# EAGLE design AutoTunerV3 (EAGLE 9.6.2)

## Sheet 1 of 4: mcu
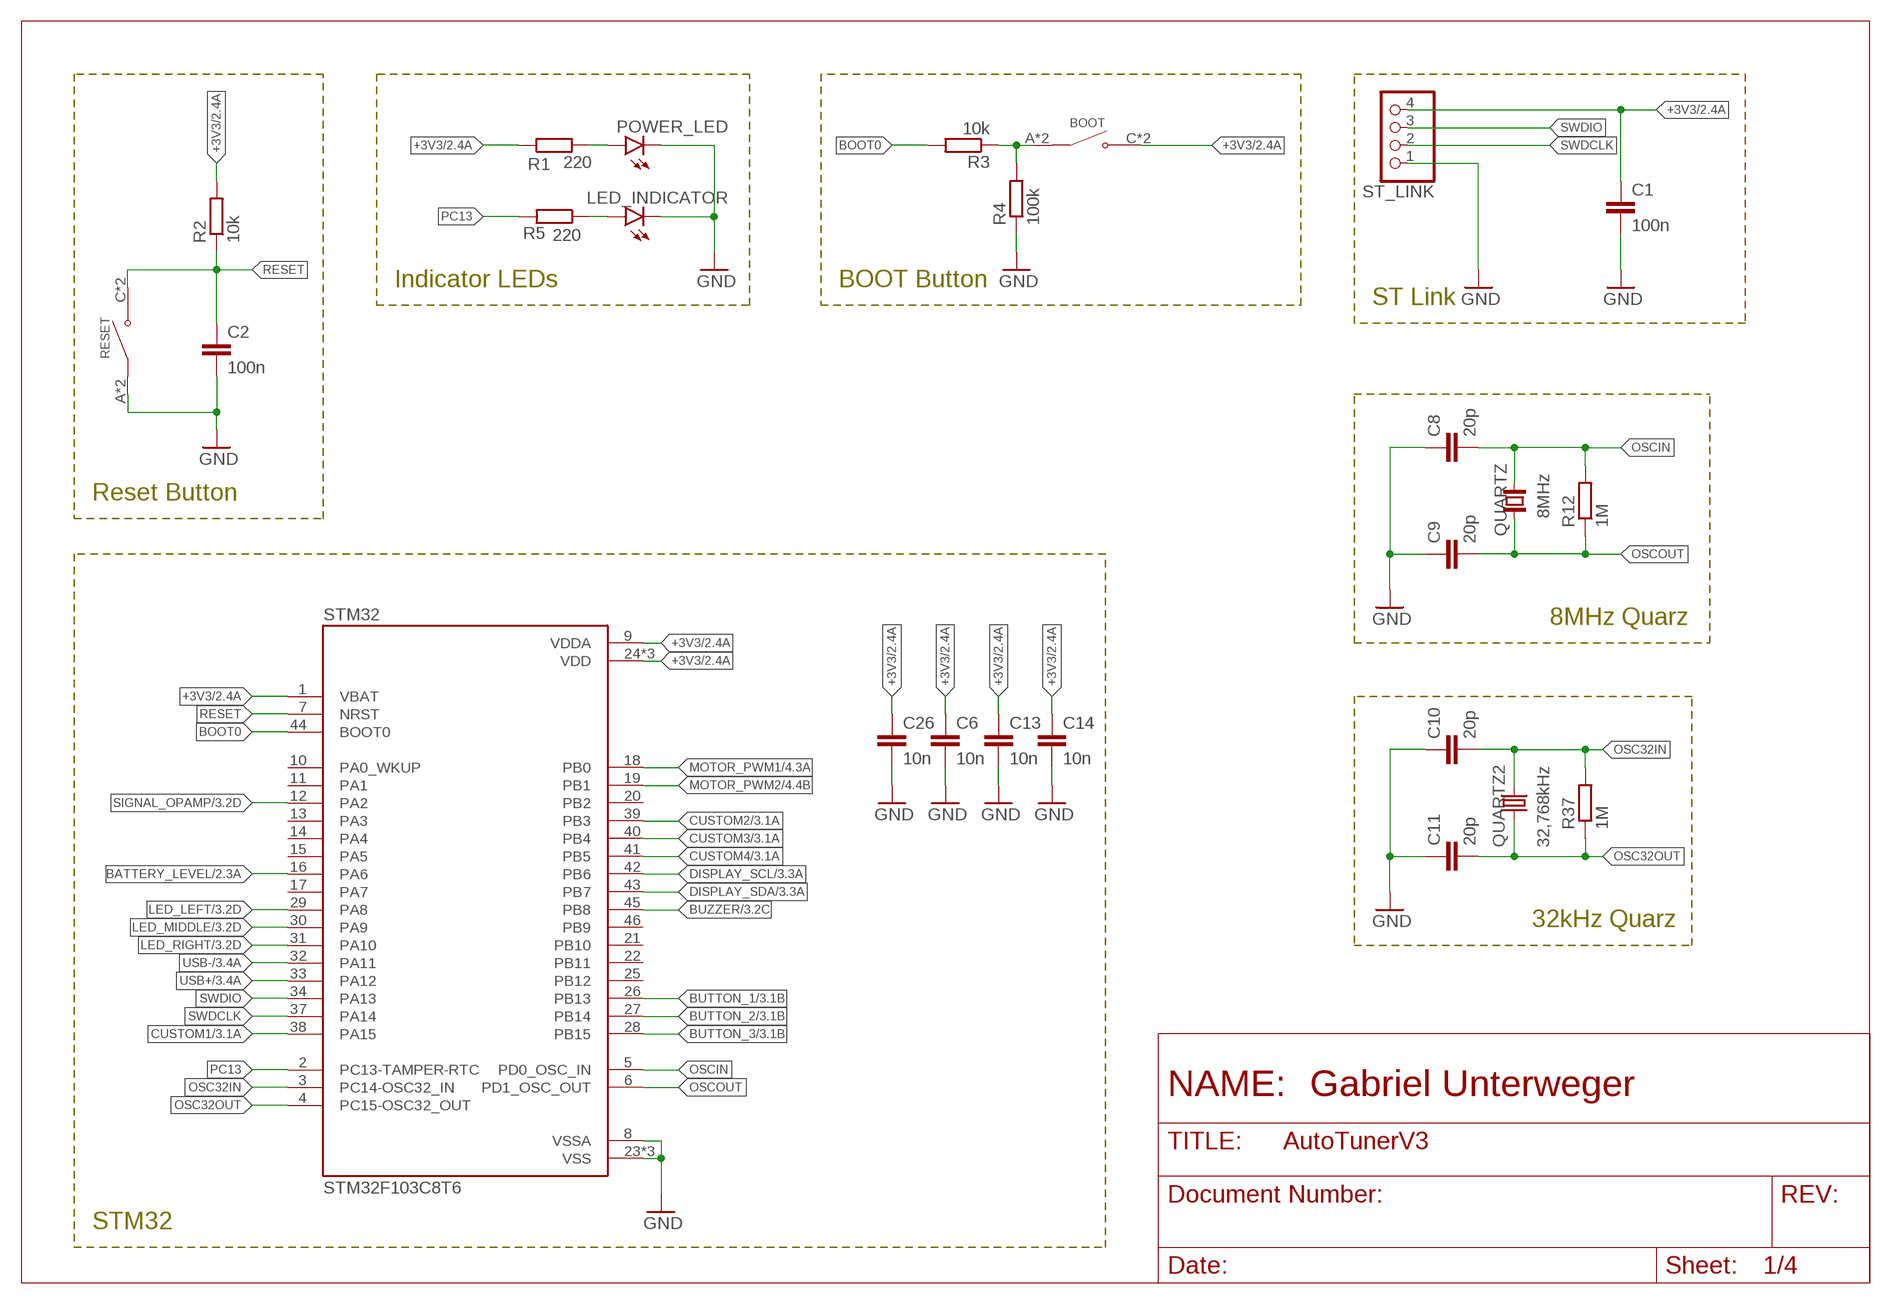
[diagram p0: schematic, sheet 1]

### Parts
BOOT  TS-1187A-B-A-B  [SW_TS-1187A-B-A-B]
C1  100n  C-EUC0805  [C0805]
C2  100n  C-EUC0805  [C0805]
C6  10n  C-EUC0805  [C0805]
C8  20p  C-EUC0805  [C0805]
C9  20p  C-EUC0805  [C0805]
C10  20p  C-EUC0805  [C0805]
C11  20p  C-EUC0805  [C0805]
C13  10n  C-EUC0805  [C0805]
C14  10n  C-EUC0805  [C0805]
C26  10n  C-EUC0805  [C0805]
LED_INDICATOR  LEDCHIPLED_0805  [CHIPLED_0805]
POWER_LED  LEDCHIPLED_0805  [CHIPLED_0805]
QUARTZ  8MHz  CRYSTAL_NX5032GA  [CRYSTAL_2-SMD-5X3]
QUARTZ2  32,768kHz  KX-327-NHF  [3.2X1.5]
R1  220  R-EU_R0805  [R0805]
R2  10k  R-EU_R0805  [R0805]
R3  10k  R-EU_R0805  [R0805]
R4  100k  R-EU_R0805  [R0805]
R5  220  R-EU_R0805  [R0805]
R12  1M  R-EU_R0805  [R0805]
R37  1M  R-EU_R0805  [R0805]
RESET  TS-1187A-B-A-B  [SW_TS-1187A-B-A-B]
ST_LINK  PINHD-1X4/90  [1X04/90]
STM32  STM32F103C8T6  [QFP50P900X900X160-48N]

### Nets
+3V3: BOOT.C(NO) BOOT.D(NO) C1.1 C6.1 C13.1 C14.1 C26.1 R1.1 R2.2 ST_LINK.4 STM32.1(VBAT) STM32.9(VDDA) STM32.24(VDD) STM32.36(VDD) STM32.48(VDD) ; also sheet 2,3,4
BATTERY_LEVEL: STM32.16(PA6) ; also sheet 2
BOOT0: R3.2 STM32.44(BOOT0)
BUTTON_1: STM32.26(PB13) ; also sheet 3
BUTTON_2: STM32.27(PB14) ; also sheet 3
BUTTON_3: STM32.28(PB15) ; also sheet 3
BUZZER: STM32.45(PB8) ; also sheet 3
CUSTOM1: STM32.38(PA15) ; also sheet 3
CUSTOM2: STM32.39(PB3) ; also sheet 3
CUSTOM3: STM32.40(PB4) ; also sheet 3
CUSTOM4: STM32.41(PB5) ; also sheet 3
DISPLAY_SCL: STM32.42(PB6) ; also sheet 3
DISPLAY_SDA: STM32.43(PB7) ; also sheet 3
GND: C1.2 C2.2 C6.2 C8.1 C9.1 C10.1 C11.1 C13.2 C14.2 C26.2 LED_INDICATOR.C POWER_LED.C R4.1 RESET.A(COM) RESET.B(COM) ST_LINK.1 STM32.8(VSSA) STM32.23(VSS) STM32.35(VSS) STM32.47(VSS) ; also sheet 2,3,4
LED_LEFT: STM32.29(PA8) ; also sheet 3
LED_MIDDLE: STM32.30(PA9) ; also sheet 3
LED_RIGHT: STM32.31(PA10) ; also sheet 3
MOTOR_PWM1: STM32.18(PB0) ; also sheet 4
MOTOR_PWM2: STM32.19(PB1) ; also sheet 4
N$1: POWER_LED.A R1.2
N$2: LED_INDICATOR.A R5.1
N$5: BOOT.A(COM) BOOT.B(COM) R3.1 R4.2
OSC32IN: C10.2 QUARTZ2.2 R37.2 STM32.3(PC14-OSC32_IN)
OSC32OUT: C11.2 QUARTZ2.1 R37.1 STM32.4(PC15-OSC32_OUT)
OSCIN: C8.2 QUARTZ.2 R12.2 STM32.5(PD0_OSC_IN)
OSCOUT: C9.2 QUARTZ.1 R12.1 STM32.6(PD1_OSC_OUT)
PC13: R5.2 STM32.2(PC13-TAMPER-RTC)
RESET: C2.1 R2.1 RESET.C(NO) RESET.D(NO) STM32.7(NRST)
SIGNAL_OPAMP: STM32.12(PA2) ; also sheet 3,4
SWDCLK: ST_LINK.2 STM32.37(PA14)
SWDIO: ST_LINK.3 STM32.34(PA13)
USB+: STM32.33(PA12) ; also sheet 3
USB-: STM32.32(PA11) ; also sheet 3
Unconnected: STM32.10(PA0_WKUP) STM32.11(PA1) STM32.13(PA3) STM32.14(PA4) STM32.15(PA5) STM32.17(PA7) STM32.20(PB2) STM32.21(PB10) STM32.22(PB11) STM32.25(PB12) STM32.46(PB9)

### Notes on the sheet
- Indicator LEDs | BOOT Button
- ST Link
- Reset Button
- 8MHz Quarz
- 32kHz Quarz
- STM32

## Sheet 2 of 4: battery / voltage converter
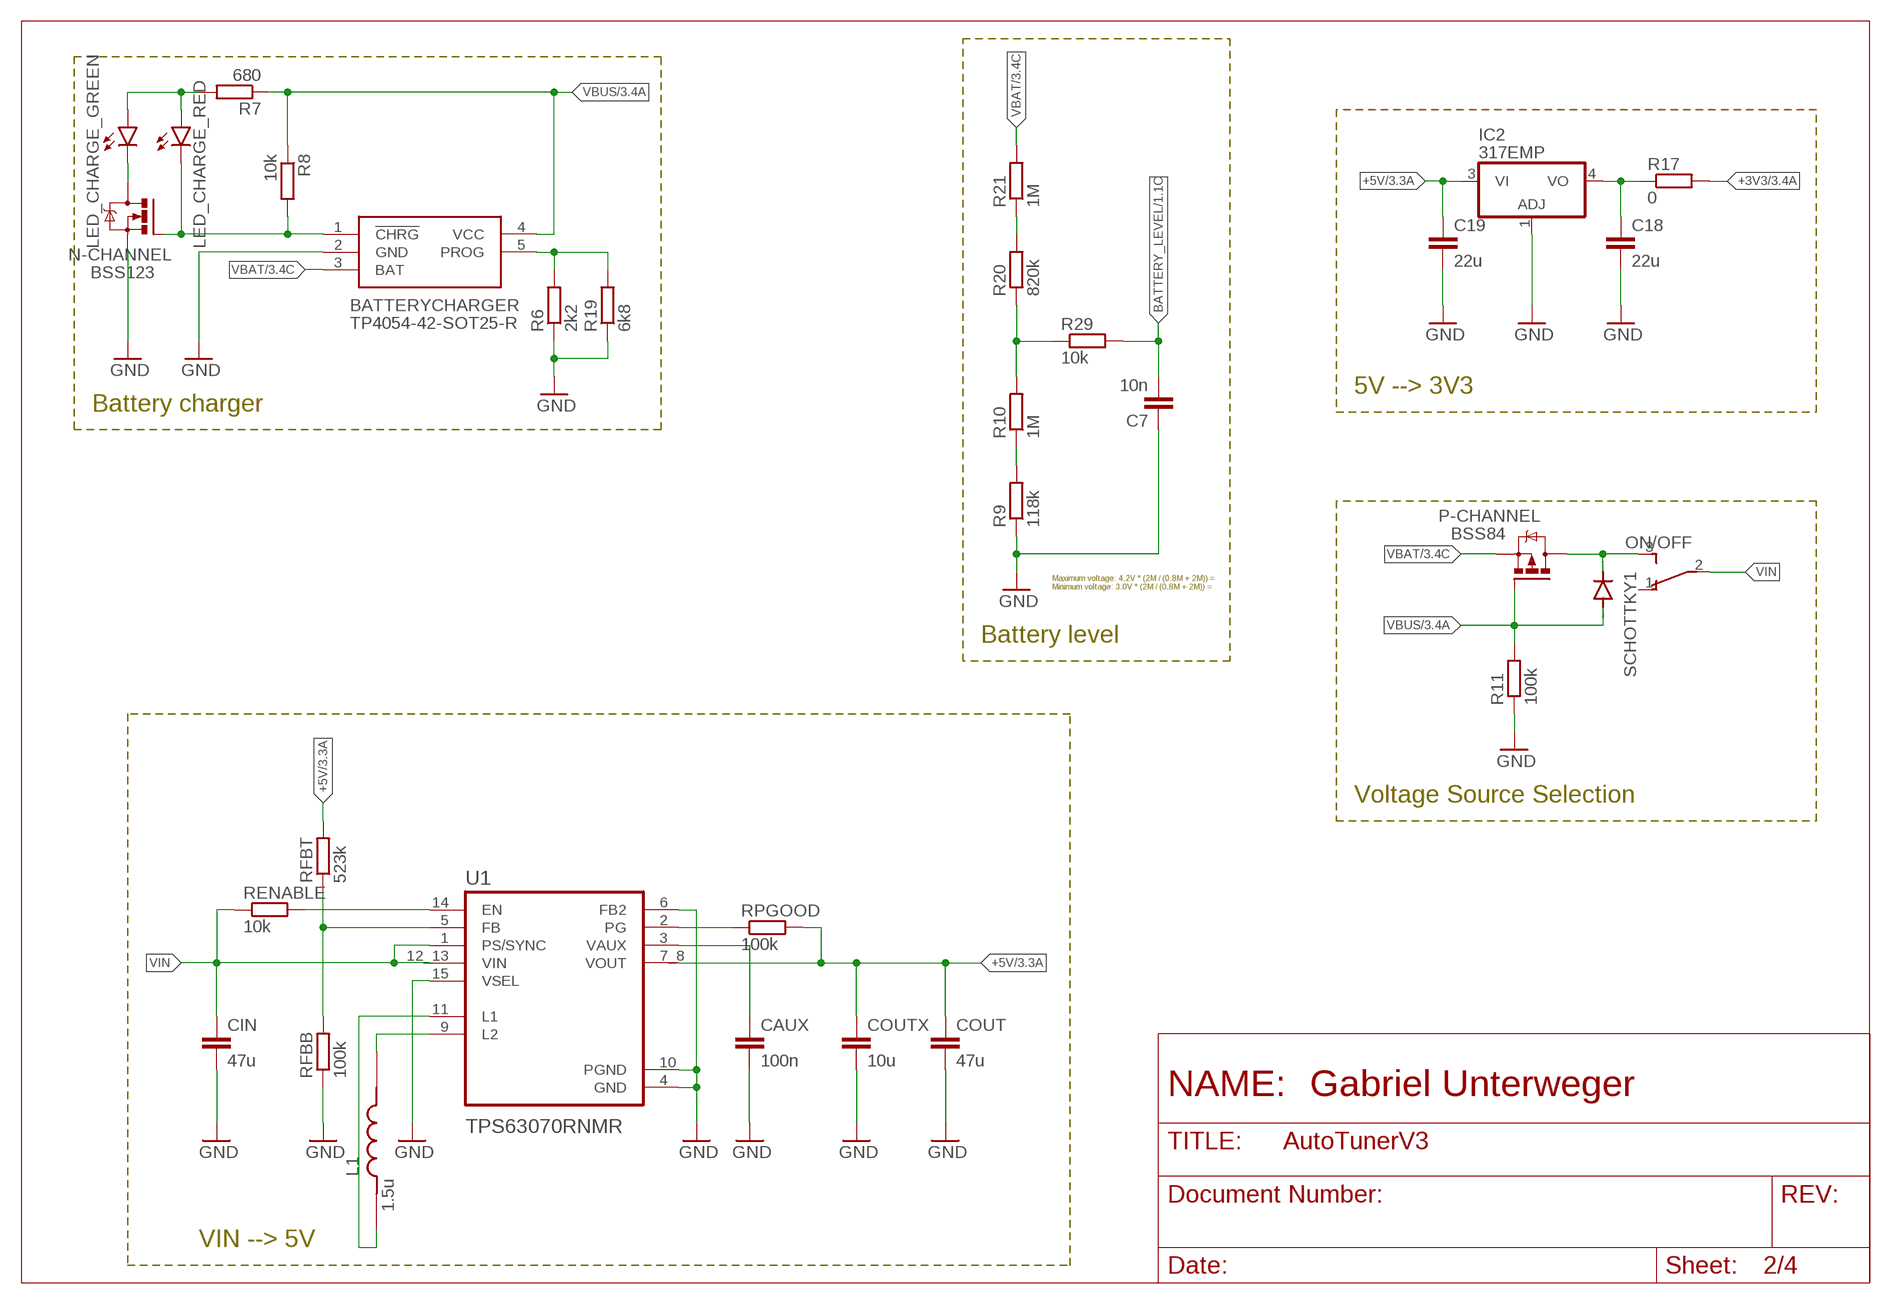
[diagram p1: schematic, sheet 2]

### Parts
BATTERYCHARGER  TP4054-42-SOT25-R  [SOT95P280X100-5N]
C7  10n  C-EUC0805  [C0805]
C18  22u  C-EUC1206  [C1206]
C19  22u  C-EUC1206  [C1206]
CAUX  100n  C-EUC0402  [C0402]
CIN  47u  C-EUC1206  [C1206]
COUT  47u  C-EUC1206  [C1206]
COUTX  10u  C-EUC0603  [C0603]
IC2  317EMP  [SOT223]
L1  1.5u  XFL4020-152MEC  [IND_XFL4020-152MEC]
LED_CHARGE_GREEN  LEDCHIPLED_0805  [CHIPLED_0805]
LED_CHARGE_RED  LEDCHIPLED_0805  [CHIPLED_0805]
N-CHANNEL  BSS123  NMOSFET_BSS123_SOT23-GSD  [SOT23]
ON/OFF  TL36PO  [TL3XPO]
P-CHANNEL  BSS84  PMOSFET_BSS84_SOT23-GSD  [SOT23]
R6  2k2  R-EU_R0805  [R0805]
R7  680  R-EU_R0805  [R0805]
R8  10k  R-EU_R0805  [R0805]
R9  118k  R-EU_R0805  [R0805]
R10  1M  R-EU_R0805  [R0805]
R11  100k  R-EU_R0805  [R0805]
R17  0  R-EU_R0805  [R0805]
R19  6k8  R-EU_R0805  [R0805]
R20  820k  R-EU_R0805  [R0805]
R21  1M  R-EU_R0805  [R0805]
R29  10k  R-EU_R0805  [R0805]
RENABLE  10k  R-EU_R0805  [R0805]
RFBB  100k  R-EU_R0805  [R0805]
RFBT  523k  R-EU_R0805  [R0805]
RPGOOD  100k  R-EU_R0805  [R0805]
SCHOTTKY1  DIODE-SOD323-R  [SOD323-R]
U1  TPS63070RNMR  [VREG_TPS63070RNMR]

### Nets
+3V3: R17.2 ; also sheet 1,3,4
+5V: C19.1 COUT.1 COUTX.1 IC2.3(VI) RFBT.2 RPGOOD.2 U1.7_8(VOUT) ; also sheet 3
BATTERY_LEVEL: C7.2 R29.2 ; also sheet 1
GND: BATTERYCHARGER.2(GND) C7.1 C18.2 C19.2 CAUX.2 CIN.2 COUT.2 COUTX.2 IC2.1(ADJ) N-CHANNEL.2(S) R6.1 R9.1 R11.1 R19.1 RFBB.1 U1.4(GND) U1.6(FB2) U1.10(PGND) U1.15(VSEL) ; also sheet 1,3,4
L1: L1.1 U1.11(L1)
L2: L1.2 U1.9(L2)
N$3: ON/OFF.3(S) P-CHANNEL.3(D) SCHOTTKY1.C
N$4: R9.2 R10.1
N$8: BATTERYCHARGER.5(PROG) R6.2 R19.2
N$9: BATTERYCHARGER.1(!CHRG) LED_CHARGE_RED.C N-CHANNEL.1(G) R8.2
N$11: LED_CHARGE_GREEN.A LED_CHARGE_RED.A R7.2
N$12: LED_CHARGE_GREEN.C N-CHANNEL.3(D)
N$13: C18.1 IC2.4(VO) R17.1
N$46: R20.2 R21.1
N$47: R10.2 R20.1 R29.1
N$60: CAUX.1 U1.3(VAUX)
N$61: RPGOOD.1 U1.2(PG)
N$62: RFBB.2 RFBT.1 U1.5(FB)
N$64: RENABLE.2 U1.14(EN)
VBAT: BATTERYCHARGER.3(BAT) P-CHANNEL.2(S) R21.2 ; also sheet 3,4
VBUS: BATTERYCHARGER.4(VCC) P-CHANNEL.1(G) R7.1 R8.1 R11.2 SCHOTTKY1.A ; also sheet 3
VIN: CIN.1 ON/OFF.2(P) RENABLE.1 U1.1(PS/SYNC) U1.12_13(VIN)
Unconnected: ON/OFF.1(O)

### Notes on the sheet
- 5V --> 3V3
- Battery charger
- Maximum voltage: 4.2V * (2M / (0.8M + 2M)) =
  Minimum voltage: 3.0V * (2M / (0.8M + 2M)) =
- Battery level
- Voltage Source Selection
- VIN --> 5V

## Sheet 3 of 4: I/O
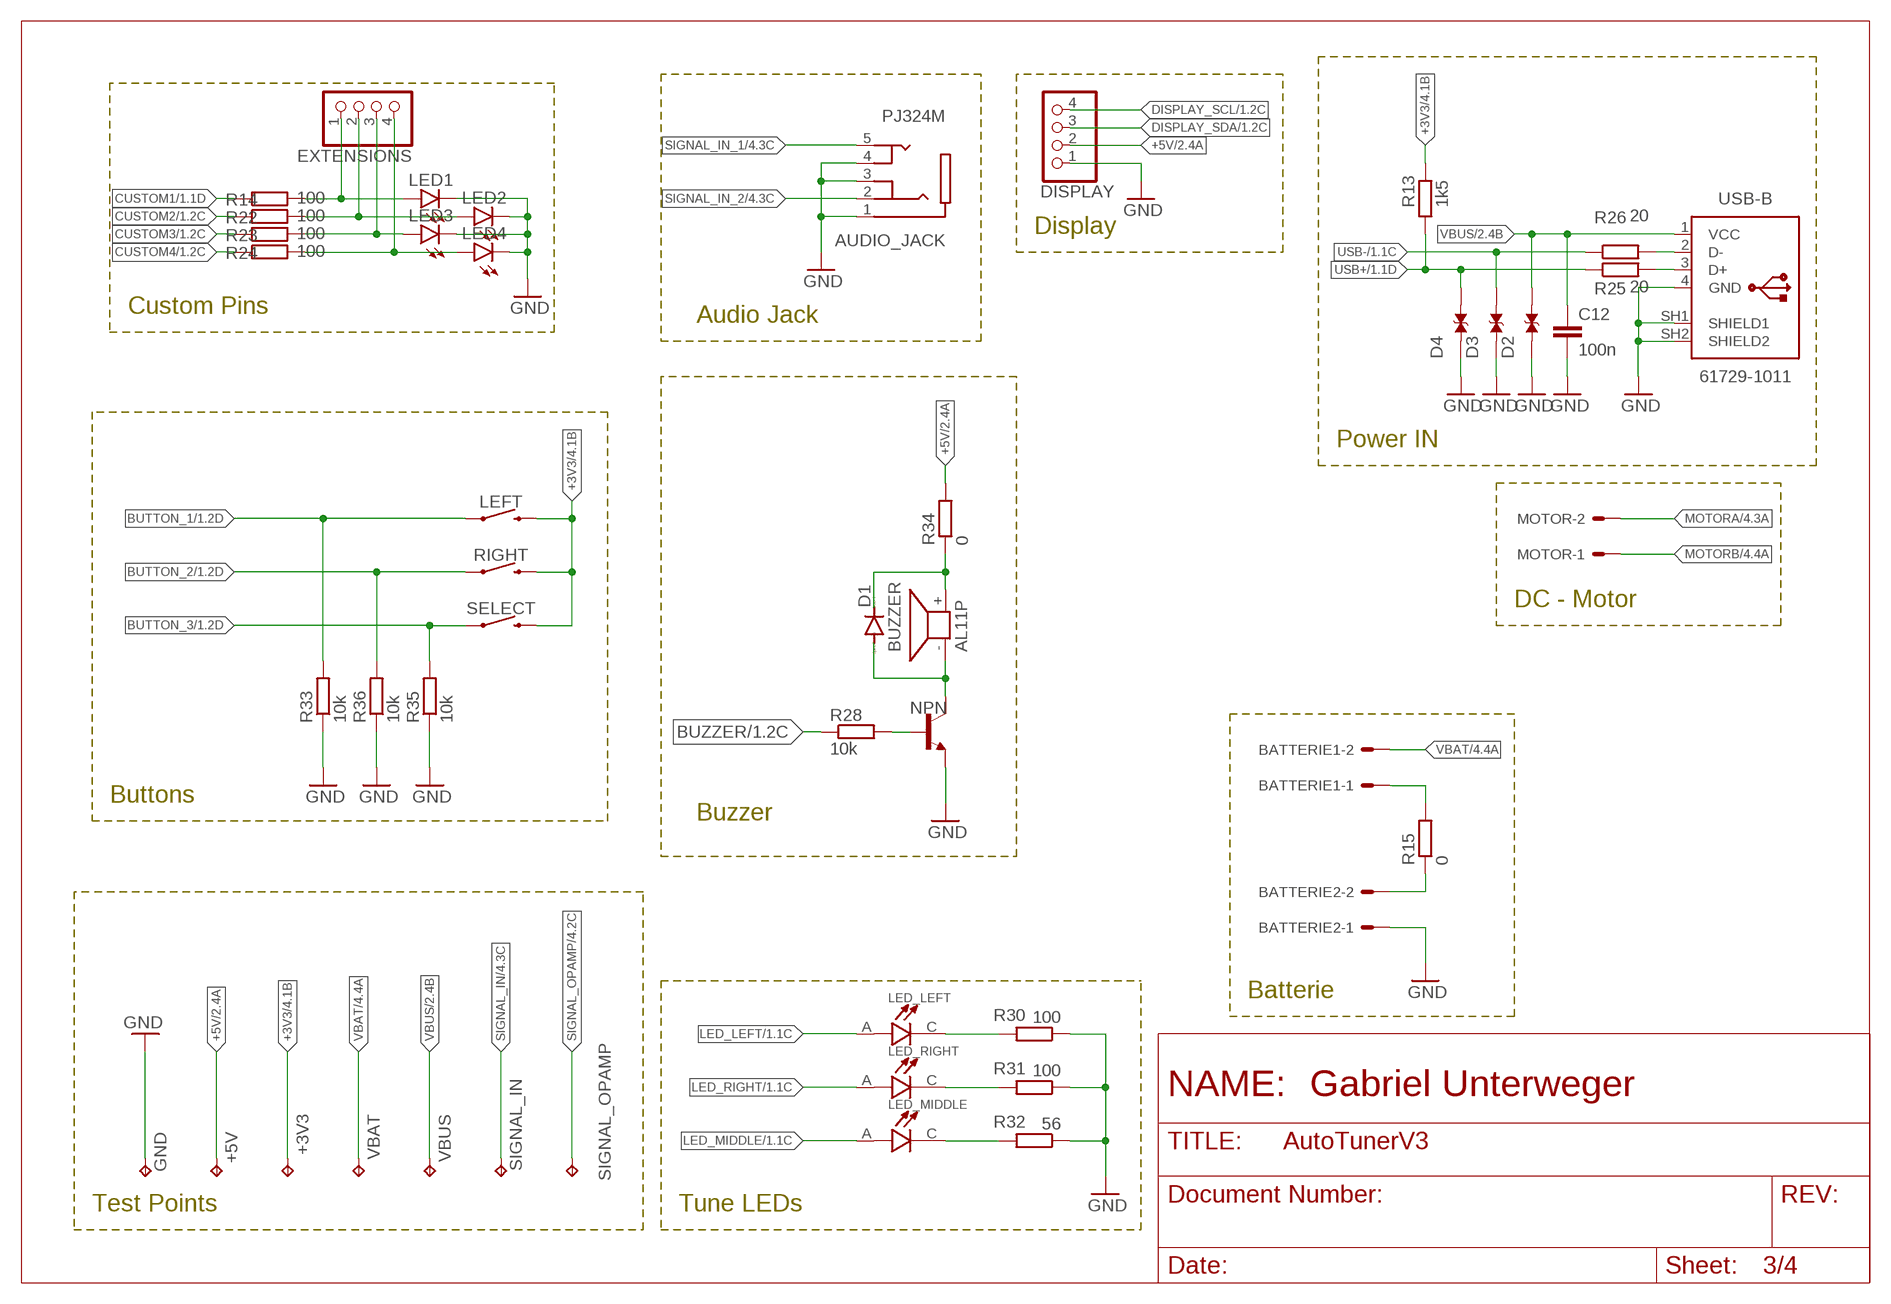
[diagram p2: schematic, sheet 3]

### Parts
+3V3  TPB1,27  [B1,27]
+5V  TPB1,27  [B1,27]
AUDIO_JACK  PJ324M  [WENZHOU_PJ324M]
BATTERIE1  22-27-2021-02  [6410-02]
BATTERIE2  22-27-2021-02  [6410-02]
BUZZER  AL11P  [AL11P]
C12  100n  C-EUC0805  [C0805]
D1  DIODE-SOD323-R  [SOD323-R]
D2  TESD5V0L1UC_RJG  [DIO_TESD5V0L1UC_RJG]
D3  TESD5V0L1UC_RJG  [DIO_TESD5V0L1UC_RJG]
D4  TESD5V0L1UC_RJG  [DIO_TESD5V0L1UC_RJG]
DISPLAY  PINHD-1X4  [1X04]
EXTENSIONS  PINHD-1X4/90  [1X04/90]
GND  TPB1,27  [B1,27]
LED1  LEDCHIP-LED0805  [CHIP-LED0805]
LED2  LEDCHIP-LED0805  [CHIP-LED0805]
LED3  LEDCHIP-LED0805  [CHIP-LED0805]
LED4  LEDCHIP-LED0805  [CHIP-LED0805]
LED_LEFT  L-53GD  [LEDRD254W50D500H1060]
LED_MIDDLE  L-53GD  [LEDRD254W50D500H1060]
LED_RIGHT  L-53GD  [LEDRD254W50D500H1060]
LEFT  MOMENTARY-SWITCH-SPST-PTH-12MM  [TACTILE_SWITCH_PTH_12MM]
MOTOR  22-27-2021-02  [6410-02]
NPN  -NPN-SOT23-EBC  [SOT23-EBC]
R13  1k5  R-EU_R0805  [R0805]
R14  100  R-EU_R0805  [R0805]
R15  0  R-EU_R0805  [R0805]
R22  100  R-EU_R0805  [R0805]
R23  100  R-EU_R0805  [R0805]
R24  100  R-EU_R0805  [R0805]
R25  20  R-EU_R0805  [R0805]
R26  20  R-EU_R0805  [R0805]
R28  10k  R-EU_R0805  [R0805]
R30  100  R-EU_R0805  [R0805]
R31  100  R-EU_R0805  [R0805]
R32  56  R-EU_R0805  [R0805]
R33  10k  R-EU_R0805  [R0805]
R34  0  R-EU_R0805  [R0805]
R35  10k  R-EU_R0805  [R0805]
R36  10k  R-EU_R0805  [R0805]
RIGHT  MOMENTARY-SWITCH-SPST-PTH-12MM  [TACTILE_SWITCH_PTH_12MM]
SELECT  MOMENTARY-SWITCH-SPST-PTH-12MM  [TACTILE_SWITCH_PTH_12MM]
SIGNAL_IN  TPB1,27  [B1,27]
SIGNAL_OPAMP  TPB1,27  [B1,27]
USB-B  61729-1011  [61729-1011BLF]
VBAT  TPB1,27  [B1,27]
VBUS  TPB1,27  [B1,27]

### Nets
+3V3: +3V3.TP LEFT.3 R13.2 RIGHT.3 SELECT.3 ; also sheet 1,2,4
+5V: +5V.TP DISPLAY.2 R34.2 ; also sheet 2
BUTTON_1: LEFT.1 R33.2 ; also sheet 1
BUTTON_2: R36.2 RIGHT.1 ; also sheet 1
BUTTON_3: R35.2 SELECT.1 ; also sheet 1
BUZZER: R28.1 ; also sheet 1
CUSTOM1: R14.1 ; also sheet 1
CUSTOM2: R22.1 ; also sheet 1
CUSTOM3: R23.1 ; also sheet 1
CUSTOM4: R24.1 ; also sheet 1
DISPLAY_SCL: DISPLAY.4 ; also sheet 1
DISPLAY_SDA: DISPLAY.3 ; also sheet 1
GND: AUDIO_JACK.1(SLEEVE) AUDIO_JACK.3(RING_2) AUDIO_JACK.4(TIP_1) BATTERIE2.1 C12.2 D2.1 D3.1 D4.1 DISPLAY.1 GND.TP LED1.C LED2.C LED3.C LED4.C NPN.E R30.1 R31.1 R32.1 R33.1 R35.1 R36.1 USB-B.4(GND) USB-B.SH1(SHIELD1) USB-B.SH2(SHIELD2) ; also sheet 1,2,4
LED_LEFT: LED_LEFT.A ; also sheet 1
LED_MIDDLE: LED_MIDDLE.A ; also sheet 1
LED_RIGHT: LED_RIGHT.A ; also sheet 1
MOTORA: MOTOR.2 ; also sheet 4
MOTORB: MOTOR.1 ; also sheet 4
N$19: LED_LEFT.C R30.2
N$20: LED_RIGHT.C R31.2
N$23: LED_MIDDLE.C R32.2
N$29: R25.2 USB-B.3(D+)
N$30: R26.2 USB-B.2(D-)
N$39: EXTENSIONS.1 LED1.A R14.2
N$48: EXTENSIONS.2 LED2.A R22.2
N$49: EXTENSIONS.3 LED3.A R23.2
N$50: EXTENSIONS.4 LED4.A R24.2
N$51: BATTERIE2.2 R15.1
N$53: BATTERIE1.1 R15.2
N$54: BUZZER.- D1.A NPN.C
N$55: BUZZER.+ D1.C R34.1
N$56: NPN.B R28.2
SIGNAL_IN: SIGNAL_IN.TP ; also sheet 4
SIGNAL_IN_1: AUDIO_JACK.5(TIP_2) ; also sheet 4
SIGNAL_IN_2: AUDIO_JACK.2(RING_1) ; also sheet 4
SIGNAL_OPAMP: SIGNAL_OPAMP.TP ; also sheet 1,4
USB+: D4.2 R13.1 R25.1 ; also sheet 1
USB-: D3.2 R26.1 ; also sheet 1
VBAT: BATTERIE1.2 VBAT.TP ; also sheet 2,4
VBUS: C12.1 D2.2 USB-B.1(VCC) VBUS.TP ; also sheet 2

### Notes on the sheet
- Display
- Custom Pins
- Audio Jack
- Power IN
- DC - Motor
- Buttons
- Buzzer
- Batterie
- Test Points | Tune LEDs

## Sheet 4 of 4: Motor Steuerung / Signal Verarbeitung
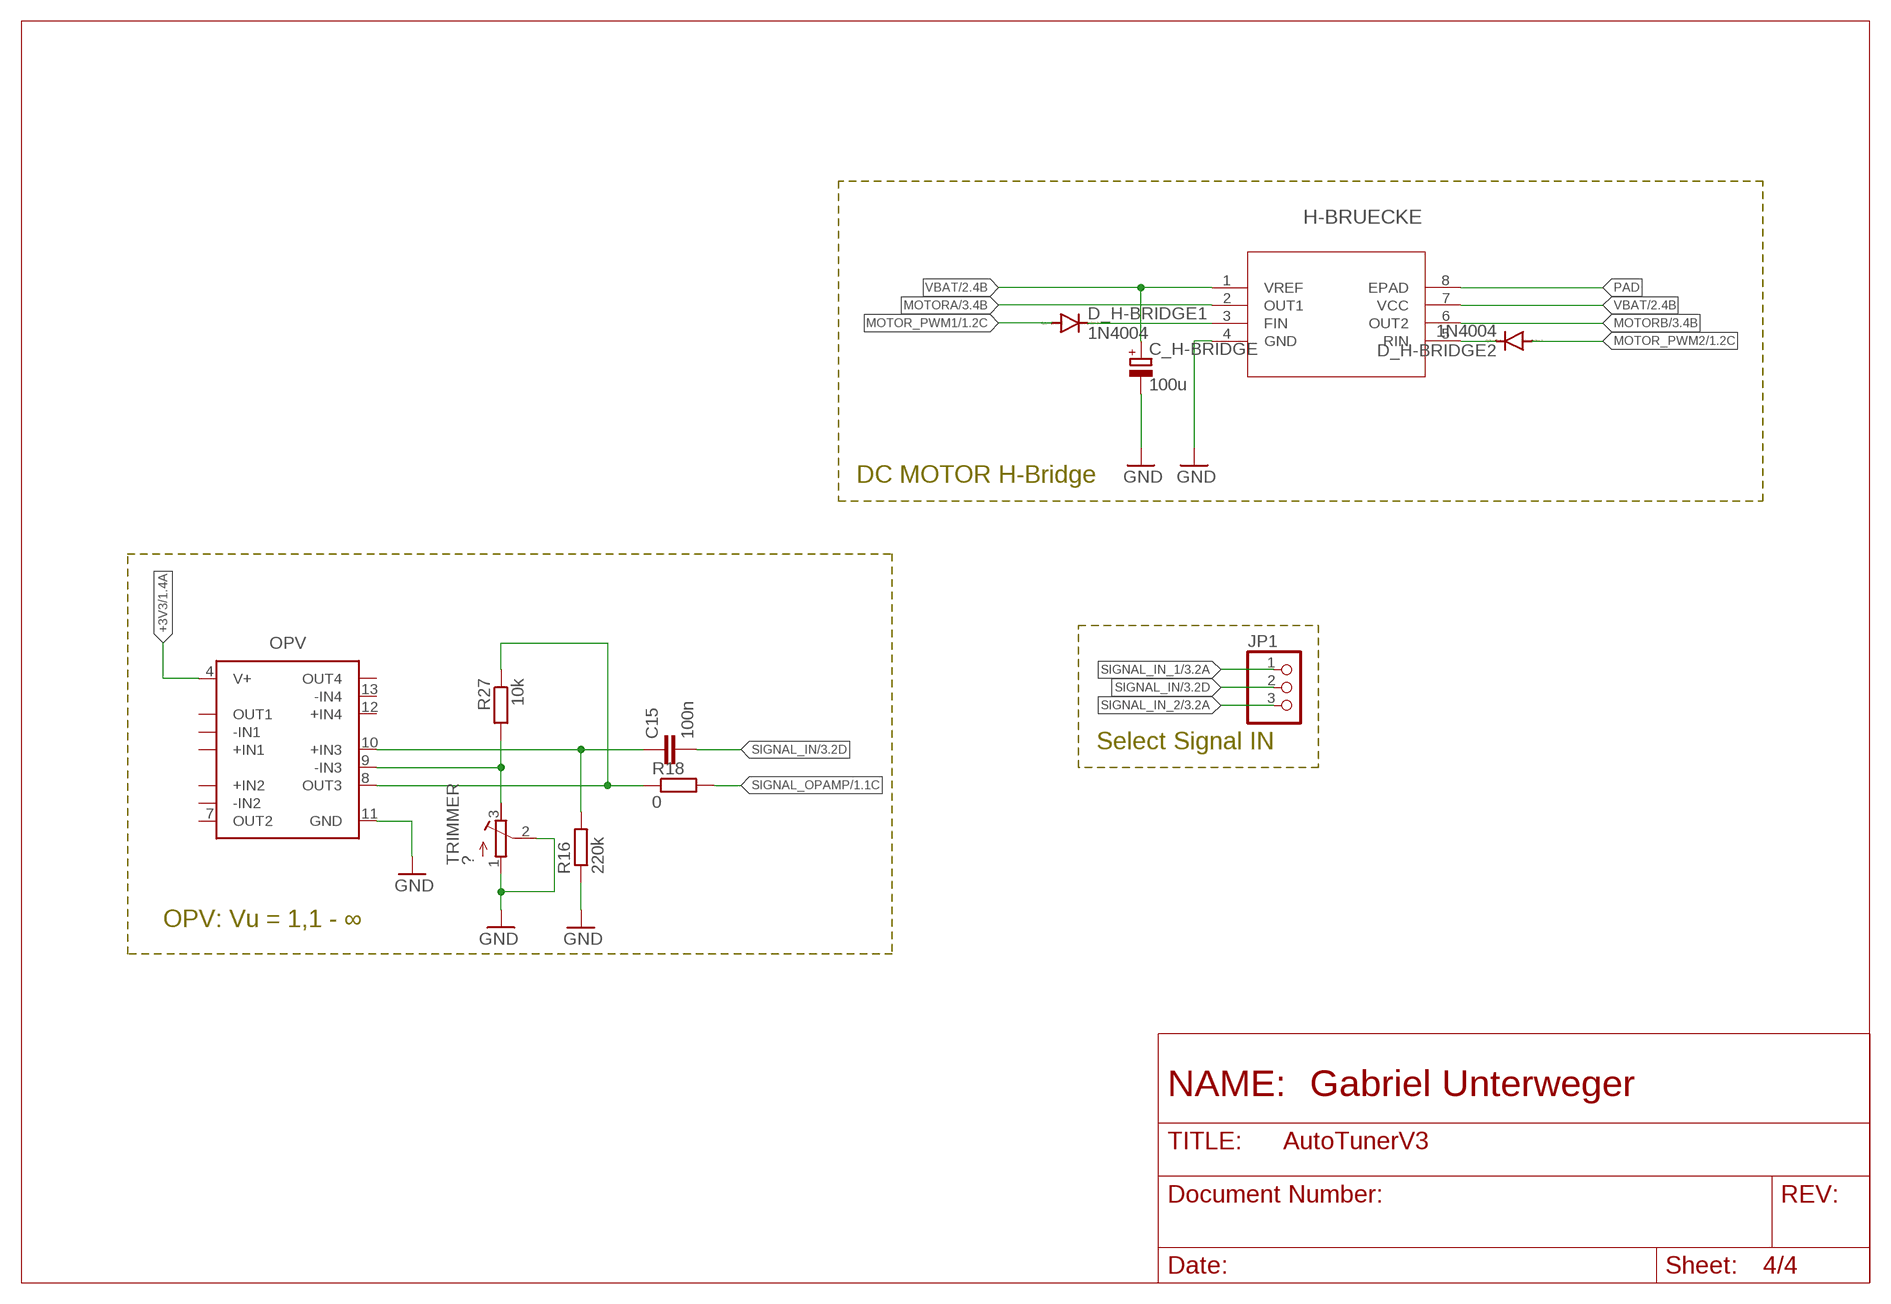
[diagram p3: schematic, sheet 4]

### Parts
C15  100n  C-EUC0805  [C0805]
C_H-BRIDGE  100u  CPOL-EUE2,5-6E  [E2,5-6E]
D_H-BRIDGE1  1N4004  [DO41-10]
D_H-BRIDGE2  1N4004  [DO41-10]
H-BRUECKE  BD6222HFP-TRHRP7_ROM-M  [HRP7_ROM-M]
JP1  PINHD-1X3  [1X03]
OPV  LM324_SOIC  [SOIC127P600X175-14N]
R16  220k  R-EU_R0805  [R0805]
R18  0  R-EU_R0805  [R0805]
R27  10k  R-EU_R0805  [R0805]
TRIMMER  ?  R-TRIMM3339P  [RTRIM3339P]

### Nets
+3V3: OPV.4(V+) ; also sheet 1,2,3
GND: C_H-BRIDGE.- H-BRUECKE.4(GND) OPV.11(GND) R16.1 TRIMMER.1(A) TRIMMER.2(S) ; also sheet 1,2,3
MOTOR_PWM1: D_H-BRIDGE1.A ; also sheet 1
MOTOR_PWM2: D_H-BRIDGE2.A ; also sheet 1
MOTORA: H-BRUECKE.2(OUT1) ; also sheet 3
MOTORB: H-BRUECKE.6(OUT2) ; also sheet 3
N$6: D_H-BRIDGE1.C H-BRUECKE.3(FIN)
N$7: OPV.8(OUT3) R18.1 R27.1
N$14: D_H-BRIDGE2.C H-BRUECKE.5(RIN)
N$16: OPV.9(-IN3) R27.2 TRIMMER.3(E)
N$52: C15.1 OPV.10(+IN3) R16.2
PAD: H-BRUECKE.8(EPAD)
SIGNAL_IN: C15.2 JP1.2 ; also sheet 3
SIGNAL_IN_1: JP1.1 ; also sheet 3
SIGNAL_IN_2: JP1.3 ; also sheet 3
SIGNAL_OPAMP: R18.2 ; also sheet 1,3
VBAT: C_H-BRIDGE.+ H-BRUECKE.1(VREF) H-BRUECKE.7(VCC) ; also sheet 2,3
Unconnected: OPV.1(OUT1) OPV.2(-IN1) OPV.3(+IN1) OPV.5(+IN2) OPV.6(-IN2) OPV.7(OUT2) OPV.12(+IN4) OPV.13(-IN4) OPV.14(OUT4)

### Notes on the sheet
- DC MOTOR H-Bridge
- Select Signal IN
- OPV: Vu = 1,1 - ∞

## Library data of the parts
+3V3 +5V GND SIGNAL_IN SIGNAL_OPAMP VBAT VBUS = testpad:TP: Test pad
AUDIO_JACK = PJ324M:PJ324M: Headphone Stereo jack/Audio connector Check availability <https://pricing.snapeda.com/parts/PJ324M/Wenzhou%20QingPu%20Electronics%20Co.Ltd/view-part?ref=eda>; AVAILABILITY: Not in stock; CHECK_PRICES: https://www.snapeda.com/parts/PJ324M/Wenzhou+QingPu+Electronics+Co.Ltd/view-part/?ref=eda; DESCRIPTION: Headphone Stereo jack/Audio connector; MF: Wenzhou QingPu Electronics Co.Ltd; MP: PJ324M; PACKAGE: Package; PRICE: None; SNAPEDA_LINK: https://www.snapeda.com/parts/PJ324M/Wenzhou+QingPu+Electronics+Co.Ltd/view-part/?ref=snap
BATTERIE1 BATTERIE2 MOTOR = con-molex:22-?-02: CONNECTOR wire to board 2.54 mm (.1 inch) pitch header; MF: MOLEX; OC_FARNELL: unknown; OC_NEWARK: unknown
BATTERYCHARGER = TP4054-42-SOT25-R:TP4054-42-SOT25-R: Standalone Linear Li-ion Battery Charger with Thermal Regulation, SOT-23-5 Source: Datasheet <http://images.100y.com.tw/pdf_file/38-TP-TP4054x.pdf>; DESCRIPTION: Standalone Linear Li-ion Battery Charger with Thermal Regulation, SOT-23-5; HEIGHT: 1mm; LCSC_PART: C32574; MANUFACTURER_NAME: TOP POWER; MANUFACTURER_PART_NUMBER: TP4054-42-SOT25-R
BOOT RESET = TS-1187A-B-A-B:TS-1187A-B-A-B: SPST 50mA @ 12VDC Top Actuated Round Button 160gf SMD Tactile Switches RoHS Check availability <https://pricing.snapeda.com/parts/TS-1187A-B-A-B/XKB%20Industrial%20Precision/view-part?ref=eda>; AVAILABILITY: Not in stock; DESCRIPTION: TS-1187A-B-A-B XKB Connectivity; LCSC_PART: C318884; MF: XKB Industrial Precision; MP: TS-1187A-B-A-B; PACKAGE: Package; PRICE: None
BUZZER = buzzer:AL11P: SPEAKER Source: Buerklin; OC_FARNELL: unknown; OC_NEWARK: unknown
C1 C2 C6-C15 C26 = rcl:C-EU: CAPACITOR, European symbol; SPICEPREFIX: C
C18 C19 = rcl:C-EU: CAPACITOR, European symbol; LCSC_PART: C12891; SPICEPREFIX: C
C_H-BRIDGE = rcl:CPOL-EU: POLARIZED CAPACITOR, European symbol; SPICEPREFIX: C
CAUX = rcl:C-EU: CAPACITOR, European symbol; LCSC_PART: C1525; SPICEPREFIX: C
CIN COUT = rcl:C-EU: CAPACITOR, European symbol; LCSC_PART: C96123; SPICEPREFIX: C
COUTX = rcl:C-EU: CAPACITOR, European symbol; LCSC_PART: C19702; SPICEPREFIX: C
D1 = diode:DIODE-: DIODE; LCSC_PART: C2128
D2-D4 = TESD5V0L1UC_RJG:TESD5V0L1UC_RJG: Check availability <https://pricing.snapeda.com/parts/TESD5V0L1UC%20RJG/Taiwan%20Semiconductor%20Corporation/view-part?ref=eda>; AVAILABILITY: In Stock; CHECK_PRICES: https://www.snapeda.com/parts/TESD5V0L1UC%20RJG/Taiwan+Semiconductor/view-part/?ref=eda; DESCRIPTION: DFN1006L, 5V, 100W, 2pF, ESD Protection Diode & Array; LCSC_PART: C7420372; MF: Taiwan Semiconductor Corporation; MP: TESD5V0L1UC RJG; PACKAGE: DFN1006L Taiwan Semiconductor; PRICE: None; PURCHASE-URL: https://www.snapeda.com/api/url_track_click_mouser/?unipart_id=3789592&manufacturer=Taiwan Semiconductor Corporation&part_name=TESD5V0L1UC RJG&search_term=protection diode; SNAPEDA_LINK: https://www.snapeda.com/parts/TESD5V0L1UC%20RJG/Taiwan+Semiconductor/view-part/?ref=snap
D_H-BRIDGE1 D_H-BRIDGE2 = diode:1N4004: DIODE general purpose rectifier, 1 A
DISPLAY EXTENSIONS ST_LINK = pinhead:PINHD-1X4: PIN HEADER
H-BRUECKE = H-Brücke_BD622HFP-TR02:BD6222HFP-TR; COPYRIGHT: Copyright (C) 2022 Ultra Librarian. All rights reserved.; MANUFACTURER_PART_NUMBER: BD6222HFP-TR; MFR_NAME: ROHM Semiconductor
IC2 = linear:*317: Positive VOLTAGE REGULATOR; LCSC_PART: C6186
JP1 = pinhead:PINHD-1X3: PIN HEADER
L1 = XFL4020-152MEC:XFL4020-152MEC: Power inductor, shielded, 20% tol, SMT, RoHS, halogen free Check availability <https://pricing.snapeda.com/parts/XFL4020-152MEC/Coilcraft/view-part?ref=eda>; AVAILABILITY: In Stock; CHECK_PRICES: https://www.snapeda.com/parts/XFL4020-152MEC/Coilcraft/view-part/?ref=eda; DESCRIPTION: Inductor Power Shielded Wirewound 1.5uH 20% 100KHz 9.1A 15.8mOhm DCR 1515 Automotive Embossed Plastic T/R; LCSC_PART: C3033018; MF: Coilcraft; MP: XFL4020-152MEC; PACKAGE: None; PRICE: None; PURCHASE-URL: https://www.snapeda.com/api/url_track_click_mouser/?unipart_id=583942&manufacturer=Coilcraft&part_name=XFL4020-152MEC&search_term=xfl4020-152mec; SNAPEDA_LINK: https://www.snapeda.com/parts/XFL4020-152MEC/Coilcraft/view-part/?ref=snap
LED1-LED4 LED_CHARGE_GREEN POWER_LED = led:LED: LED OSRAM: - CHIPLED LG R971, LG N971, LY N971, LG Q971, LY Q971, LO R971, LY R971 LH N974, LH R974 LS Q976, LO Q976, LY Q976 LO Q996 - Hyper CHIPLED LW Q18S LB Q993, LB Q99A, LB R99A - SideLED LS A670, LO A670, LY A670, LG A670, LP A670 LB A673, LV A673, LT A673, LW A673 LH A674 LY A675 LS A676, LA A676, LO A676, LY A676, LW A676 LS A679, LY A679, LG A679 - Hyper Micro SIDELED® LS Y876, LA Y876, LO Y876, LY Y876 LT Y87S - SmartLED LW L88C, LW L88S LB L89C, LB L89S, LG L890 LS L89K, LO L89K, LY L89K LS L896, LA L896, LO L896, LY L896 - TOPLED LS T670, LO T670, LY T670, LG T670, LP T670 LSG T670, LSP T670, LSY T670, LOP T670, LYG T670 LG T671, LOG T671, LSG T671 LB T673, LV T673, LT T673, LW T673 LH T674 LS T676, LA T676, LO T676, LY T676, LB T676, LH T676, LSB T676, LW T676 LB T67C, LV T67C, LT T67C, LS T67K, LO T67K, LY T67K, LW E67C LS E67B, LA E67B, LO E67B, LY E67B, LB E67C, LV E67C, LT E67C LW T67C LS T679, LY T679, LG T679 LS T770, LO T770, LY T770, LG T770, LP T770 LB T773, LV T773, LT T773, LW T773 LH T774 LS E675, LA E675, LY E675, LS T675 LS T776, LA T776, LO T776, LY T776, LB T776 LHGB T686 LT T68C, LB T68C - Hyper Mini TOPLED® LB M676 - Mini TOPLED Santana® LG M470 LS M47K, LO M47K, LY M47K Source: http://www.osram.convergy.de LUXEON: - LUMILED® LXK2-PW12-R00, LXK2-PW12-S00, LXK2-PW14-U00, LXK2-PW14-V00 LXK2-PM12-R00, LXK2-PM12-S00, LXK2-PM14-U00 LXK2-PE12-Q00, LXK2-PE12-R00, LXK2-PE12-S00, LXK2-PE14-T00, LXK2-PE14-U00 LXK2-PB12-K00, LXK2-PB12-L00, LXK2-PB12-M00, LXK2-PB14-N00, LXK2-PB14-P00, LXK2-PB14-Q00 LXK2-PR12-L00, LXK2-PR12-M00, LXK2-PR14-Q00, LXK2-PR14-R00 LXK2-PD12-Q00, LXK2-PD12-R00, LXK2-PD12-S00 LXK2-PH12-R00, LXK2-PH12-S00 LXK2-PL12-P00, LXK2-PL12-Q00, LXK2-PL12-R00 Source: www.luxeon.com KINGBRIGHT: KA-3528ASYC Source: www.kingbright.com; LCSC_PART: C2297
LED_CHARGE_RED = led:LED: LED OSRAM: - CHIPLED LG R971, LG N971, LY N971, LG Q971, LY Q971, LO R971, LY R971 LH N974, LH R974 LS Q976, LO Q976, LY Q976 LO Q996 - Hyper CHIPLED LW Q18S LB Q993, LB Q99A, LB R99A - SideLED LS A670, LO A670, LY A670, LG A670, LP A670 LB A673, LV A673, LT A673, LW A673 LH A674 LY A675 LS A676, LA A676, LO A676, LY A676, LW A676 LS A679, LY A679, LG A679 - Hyper Micro SIDELED® LS Y876, LA Y876, LO Y876, LY Y876 LT Y87S - SmartLED LW L88C, LW L88S LB L89C, LB L89S, LG L890 LS L89K, LO L89K, LY L89K LS L896, LA L896, LO L896, LY L896 - TOPLED LS T670, LO T670, LY T670, LG T670, LP T670 LSG T670, LSP T670, LSY T670, LOP T670, LYG T670 LG T671, LOG T671, LSG T671 LB T673, LV T673, LT T673, LW T673 LH T674 LS T676, LA T676, LO T676, LY T676, LB T676, LH T676, LSB T676, LW T676 LB T67C, LV T67C, LT T67C, LS T67K, LO T67K, LY T67K, LW E67C LS E67B, LA E67B, LO E67B, LY E67B, LB E67C, LV E67C, LT E67C LW T67C LS T679, LY T679, LG T679 LS T770, LO T770, LY T770, LG T770, LP T770 LB T773, LV T773, LT T773, LW T773 LH T774 LS E675, LA E675, LY E675, LS T675 LS T776, LA T776, LO T776, LY T776, LB T776 LHGB T686 LT T68C, LB T68C - Hyper Mini TOPLED® LB M676 - Mini TOPLED Santana® LG M470 LS M47K, LO M47K, LY M47K Source: http://www.osram.convergy.de LUXEON: - LUMILED® LXK2-PW12-R00, LXK2-PW12-S00, LXK2-PW14-U00, LXK2-PW14-V00 LXK2-PM12-R00, LXK2-PM12-S00, LXK2-PM14-U00 LXK2-PE12-Q00, LXK2-PE12-R00, LXK2-PE12-S00, LXK2-PE14-T00, LXK2-PE14-U00 LXK2-PB12-K00, LXK2-PB12-L00, LXK2-PB12-M00, LXK2-PB14-N00, LXK2-PB14-P00, LXK2-PB14-Q00 LXK2-PR12-L00, LXK2-PR12-M00, LXK2-PR14-Q00, LXK2-PR14-R00 LXK2-PD12-Q00, LXK2-PD12-R00, LXK2-PD12-S00 LXK2-PH12-R00, LXK2-PH12-S00 LXK2-PL12-P00, LXK2-PL12-Q00, LXK2-PL12-R00 Source: www.luxeon.com KINGBRIGHT: KA-3528ASYC Source: www.kingbright.com; LCSC_PART: C84256
LED_INDICATOR = led:LED: LED OSRAM: - CHIPLED LG R971, LG N971, LY N971, LG Q971, LY Q971, LO R971, LY R971 LH N974, LH R974 LS Q976, LO Q976, LY Q976 LO Q996 - Hyper CHIPLED LW Q18S LB Q993, LB Q99A, LB R99A - SideLED LS A670, LO A670, LY A670, LG A670, LP A670 LB A673, LV A673, LT A673, LW A673 LH A674 LY A675 LS A676, LA A676, LO A676, LY A676, LW A676 LS A679, LY A679, LG A679 - Hyper Micro SIDELED® LS Y876, LA Y876, LO Y876, LY Y876 LT Y87S - SmartLED LW L88C, LW L88S LB L89C, LB L89S, LG L890 LS L89K, LO L89K, LY L89K LS L896, LA L896, LO L896, LY L896 - TOPLED LS T670, LO T670, LY T670, LG T670, LP T670 LSG T670, LSP T670, LSY T670, LOP T670, LYG T670 LG T671, LOG T671, LSG T671 LB T673, LV T673, LT T673, LW T673 LH T674 LS T676, LA T676, LO T676, LY T676, LB T676, LH T676, LSB T676, LW T676 LB T67C, LV T67C, LT T67C, LS T67K, LO T67K, LY T67K, LW E67C LS E67B, LA E67B, LO E67B, LY E67B, LB E67C, LV E67C, LT E67C LW T67C LS T679, LY T679, LG T679 LS T770, LO T770, LY T770, LG T770, LP T770 LB T773, LV T773, LT T773, LW T773 LH T774 LS E675, LA E675, LY E675, LS T675 LS T776, LA T776, LO T776, LY T776, LB T776 LHGB T686 LT T68C, LB T68C - Hyper Mini TOPLED® LB M676 - Mini TOPLED Santana® LG M470 LS M47K, LO M47K, LY M47K Source: http://www.osram.convergy.de LUXEON: - LUMILED® LXK2-PW12-R00, LXK2-PW12-S00, LXK2-PW14-U00, LXK2-PW14-V00 LXK2-PM12-R00, LXK2-PM12-S00, LXK2-PM14-U00 LXK2-PE12-Q00, LXK2-PE12-R00, LXK2-PE12-S00, LXK2-PE14-T00, LXK2-PE14-U00 LXK2-PB12-K00, LXK2-PB12-L00, LXK2-PB12-M00, LXK2-PB14-N00, LXK2-PB14-P00, LXK2-PB14-Q00 LXK2-PR12-L00, LXK2-PR12-M00, LXK2-PR14-Q00, LXK2-PR14-R00 LXK2-PD12-Q00, LXK2-PD12-R00, LXK2-PD12-S00 LXK2-PH12-R00, LXK2-PH12-S00 LXK2-PL12-P00, LXK2-PL12-Q00, LXK2-PL12-R00 Source: www.luxeon.com KINGBRIGHT: KA-3528ASYC Source: www.kingbright.com; LCSC_PART: C2296
LED_LEFT LED_MIDDLE LED_RIGHT = L-53GD:L-53GD: LED; 5mm; green; 5-32mcd; 60°; Front: convex Check availability <https://pricing.snapeda.com/parts/L-53GD/Kingbright/view-part?ref=eda>; AVAILABILITY: In Stock; CHECK_PRICES: https://www.snapeda.com/parts/L-53GD/Kingbright/view-part/?ref=eda; DESCRIPTION: LED; 5mm; green; 5-32mcd; 60°; Front: convex; MF: Kingbright; MP: L-53GD; PACKAGE: CDIP-28 Kingbright; PRICE: None; PURCHASE-URL: https://www.snapeda.com/api/url_track_click_mouser/?unipart_id=525636&manufacturer=Kingbright&part_name=L-53GD&search_term=led, 5mm; SNAPEDA_LINK: https://www.snapeda.com/parts/L-53GD/Kingbright/view-part/?ref=snap
LEFT RIGHT SELECT = SparkFun-Switches:MOMENTARY-SWITCH-SPST: Momentary Switch (Pushbutton) - SPST Normally-open (NO) SPST momentary switches (buttons, pushbuttons). Variants PTH-12MM - 12mm square, through-hole Momentary Pushbutton Switch - 12mm Square <https://www.sparkfun.com/products/9190> (COM-09190) PTH-6.0MM, PTH-6.0MM-KIT - 6.0mm square, through-hole Mini Pushbutton Switch <https://www.sparkfun.com/products/97> (COM-00097) KIT package intended for soldering kit's - only one side of pads' copper is exposed. PTH-RIGHT-ANGLE-KIT - Right-angle, through-hole Right Angle Tactile Button <https://www.sparkfun.com/products/10791> - Used on SparkFun BigTime Watch Kit <https://www.sparkfun.com/products/11734> SMD-12MM - 12mm square, surface-mount Tactile Button - SMD (12mm) <https://www.sparkfun.com/products/12993> (COM-12993) Used on SparkFun PicoBoard <https://www.sparkfun.com/products/11888> SMD-4.5MM - 4.5mm Square Trackball Switch Used on SparkFun Blackberry Trackballer Breakout <https://www.sparkfun.com/products/13169> SMD-4.6MMX2.8MM - 4.60mm x 2.80mm, surface mount Used on SparkFun Pro Micro - RP2040 <https://www.sparkfun.com/products/17717> SMD-5.2MM, SMD-5.2-REDUNDANT - 5.2mm square, surface-mount Mini Pushbutton Switch - SMD <https://www.sparkfun.com/products/8720> (COM-08720) Used on Arduino Pro Mini <https://www.sparkfun.com/products/11114> REDUNDANT package connects both switch circuits together SMD-6.0X3.5MM - 6.0 x 3.5mm, surface mount Momentary Reset Switch SMD <https://www.sparkfun.com/products/8229> (COM-08229) SMD-6.2MM-TALL - 6.2mm square, surface mount Tactile Button - SMD (6mm) <https://www.sparkfun.com/products/12992> Used on SparkFun Digital Sandbox <https://www.sparkfun.com/products/12651> SMD-RIGHT-ANGLE - Right-angle, surface mount Used on SparkFun Block for Intel® Edison - Arduino <https://www.sparkfun.com/products/13036>; PROD_ID: SWCH-09185; SF_SKU: COM-09190
N-CHANNEL = Transistor:NMOSFET_: N-Channel MOSFET - Popular parts; CATEGORY: Transistor; DESCRIPTION: MOSFET N-CH 100V 0.17A SOT-23; DRAIN_CURRENT: 170mA; LCSC_PART: C20917; MANUFACTURER: ON Semiconductor; MPN: BSS123L; OPERATING_TEMP: -55°C ~ 150°C; PART_STATUS: Active; ROHS_COMPLIANT: Yes; SUB-CATEGORY: MOSFET; THERMALLOSS: 360mW; TYPE: N-Channel
NPN = transistor:*-NPN-: NPN Transistror BF959 corrected 2008.03.06; LCSC_PART: C364312
ON/OFF = switch:TL36PO: TINY SWITCH ON - ON Source: http://www2.produktinfo.conrad.com/datenblaetter/700000-724999/705152-da-01-de-Subminiaturschalter_TL_36YO.pdf
OPV = IC_Linear:LM324: Quad-Operational Amplifiers Reference Datasheet <https://www.ti.com/lit/ds/snosc16d/snosc16d.pdf>; CATEGORY: Operational Amplifiers; DESCRIPTION: Quad-Operational Amplifiers; LCSC_PART: C71035; MANUFACTURER: Generic; MPN: Generic; SERIES: LM324; SUB-CATEGORY: Amplifier ICs; TYPE: Op Amps - Operational Amplifiers
P-CHANNEL = Transistor:PMOSFET_: P-Channel MOSFET - Popular parts; CATEGORY: Transistor; DESCRIPTION: MOSFET P-CH 50V 130MA SOT-23; DRAIN_CURRENT: 130mA; LCSC_PARTS: C10487; MANUFACTURER: ON Semiconductor; MPN: BSS84; OPERATING_TEMP: -55°C ~ 150°C; PART_STATUS: Active; ROHS_COMPLIANT: Yes; SUB-CATEGORY: MOSFET; THERMALLOSS: 360mW; TYPE: P-Channel
QUARTZ = 52101-101-REV-A_v16:CRYSTAL_NX5032GA: CRYSTAL; LCSC_PART: C115962
QUARTZ2 = crystal-geyer_V1_0:KX-327: Tuning Fork Crystals (kHz) SMD: KX327 - Serie Model Size l/w/h [mm] Frequency Range Frequency Stability Temp. Range [°C] Load Capacitance AECQ 200 availabel Datasheet KX-327VT KX-327FT KX-327RT KX-327NHT KX-327NHF KX-327L KX-327S 1.25/1.05/0.5 1.6/1.0/0.5 2.0/1.2/0.6 3.2/1.5/0.8 3.2/1.5/0.8 7.0/1.5/1.4 8.2/3.8/2.5 32,768 kHz 32,768 kHz 32,768 kHz 32,768 kHz 32,768 kHz 32,768 kHz 32,768 kHz ±10 … ±20ppm ±10 … ±20ppm ±10 … ±20ppm ±10 … ±20ppm ±10 … ±20ppm ±10 … ±20ppm ±5 … ±20ppm (*) -40°C …+85°C (*) -40°C …+85°C (*) -40°C …+85°C (*) -40°C …+85°C (*) -40°C …+125°C (*) -40°C …+85°C (*) -40°C …+85°C 7/9/12,5 7/9/12,5 7/9/12,6 7/9/12,5 9/12,5 7/9/12,5 6/12,5 - - - - yes - - KX-327VT.pdf <http://www.geyer-electronic.de/uploads/tx_userartikelfrequenz/GEYER-KX-327VT.pdf> KX-327FT.pdf <http://www.geyer-electronic.de/uploads/tx_userartikelfrequenz/GEYER-KX-327FT.pdf> KX-327RT.pdf <http://www.geyer-electronic.de/uploads/tx_userartikelfrequenz/GEYER-KX-327RT.pdf> KX-327NHT.pdf <http://www.geyer-electronic.de/uploads/tx_userartikelfrequenz/GEYER-KX-327NHT.pdf> KX-327NHF.pdf <http://www.geyer-electronic.de/uploads/tx_userartikelfrequenz/GEYER-KX-327NHF.pdf> KX-327L.pdf <http://www.geyer-electronic.de/uploads/tx_userartikelfrequenz/GEYER-KX-327L.pdf> KX-327S.pdf <http://www.geyer-electronic.de/uploads/tx_userartikelfrequenz/GEYER-KX-327S.pdf> <http://www.geyer-electronic.de/fileadmin/template/img/logo-geyer-electronic.png> Details see: http://www.geyer-electronic.de/Frequenz-Produkte.9.0.html Created 2016-06-07, Hans Locher 2016 (C) Geyer Quartz Technology KX327VT,KX327FT,KX327RT,KX327NHT,KX327NHF,KX327S,KX327L;125105;1610;2012;3215;7015;8238;1,25x1,05,1.25x1.05;1,6x1,0,1.6x1.0;2,0x1,2,2.0x1.2;3,2x1,5,3.2x1.5;8,2x3,8,8.2x3.8,7.0x1.5,7,0x1,532.768kHz; LCSC_PART: C32346
R1 = rcl:R-EU_: RESISTOR, European symbol; LCSC_PART: C17557; SPICEPREFIX: R
R2-R4 R6-R37 RENABLE RFBB RFBT RPGOOD = rcl:R-EU_: RESISTOR, European symbol; SPICEPREFIX: R
R5 = rcl:R-EU_: RESISTOR, European symbol; LCSC_PART: C17802; SPICEPREFIX: R
SCHOTTKY1 = diode:DIODE-: DIODE; LCSC_PART: C191023
STM32 = STM32F103C8T6:STM32F103C8T6: Mainstream Performance line, ARM Cortex-M3 MCU with 64 Kbytes Flash, 72 MHz CPU, motor control, USB and CAN Check availability <https://pricing.snapeda.com/parts/STM32F103C8T6/STMicroelectronics/view-part?ref=eda>; AVAILABILITY: In Stock; CHECK_PRICES: https://www.snapeda.com/parts/STM32F103C8T6/STMicroelectronics/view-part/?ref=eda; DESCRIPTION: ARM® Cortex®-M3 STM32F1 Microcontroller IC 32-Bit 72MHz 64KB (64K x 8) FLASH 48-LQFP (7x7); LCSC_PART: C8734; MF: STMicroelectronics; MP: STM32F103C8T6; PACKAGE: LQFP-48 STMicroelectronics; PRICE: None; PURCHASE-URL: https://www.snapeda.com/api/url_track_click_mouser/?unipart_id=52195&manufacturer=STMicroelectronics&part_name=STM32F103C8T6&search_term=stm32f103c8t6; SNAPEDA_LINK: https://www.snapeda.com/parts/STM32F103C8T6/STMicroelectronics/view-part/?ref=snap
TRIMMER = rcl:R-TRIMM: Trimm resistor; SPICEMODEL: X; SPICEPREFIXL: POT
U1 = TPS63070RNMR:TPS63070RNMR: Check availability <https://pricing.snapeda.com/parts/TPS63070RNMR/Texas%20Instruments/view-part?ref=eda>; AVAILABILITY: In Stock; CHECK_PRICES: https://www.snapeda.com/parts/TPS63070RNMR/Texas+Instruments/view-part/?ref=eda; DESCRIPTION: Wide input voltage (2V-16V) buck-boost converter; LCSC_PART: C109322; MF: Texas Instruments; MP: TPS63070RNMR; PACKAGE: VQFN-HR-15 Texas Instruments; PRICE: None; PURCHASE-URL: https://www.snapeda.com/api/url_track_click_mouser/?unipart_id=583017&manufacturer=Texas Instruments&part_name=TPS63070RNMR&search_term=tps63070rnmr; SNAPEDA_LINK: https://www.snapeda.com/parts/TPS63070RNMR/Texas+Instruments/view-part/?ref=snap
USB-B = Connector_USB:61729-1011: USB(2.0) Type-B, RCPT, 4POS, THT-R/A Datasheet <https://www.amphenol-icc.com/media/wysiwyg/files/drawing/61729.pdf>; CATEGORY: Connector; CONTACTS: 4; CURRENT_RATING: 1A; DESCRIPTION: CONN RCPT USB2.0 TYPEB 4POS R/A; GENDER: Receptacle; MANUFACTURER: Amphenol ICC (FCI); MOUNT_TYPE: R/A; MPN: 61729-1011BLF; OPERATING_TEMP: -55°C to 85°C; PART_STATUS: Active; ROHS_COMPLIANT: RoHS Compliant; SERIES: 61729; SUB-CATEGORY: USB; TYPE: USB-B

## Board
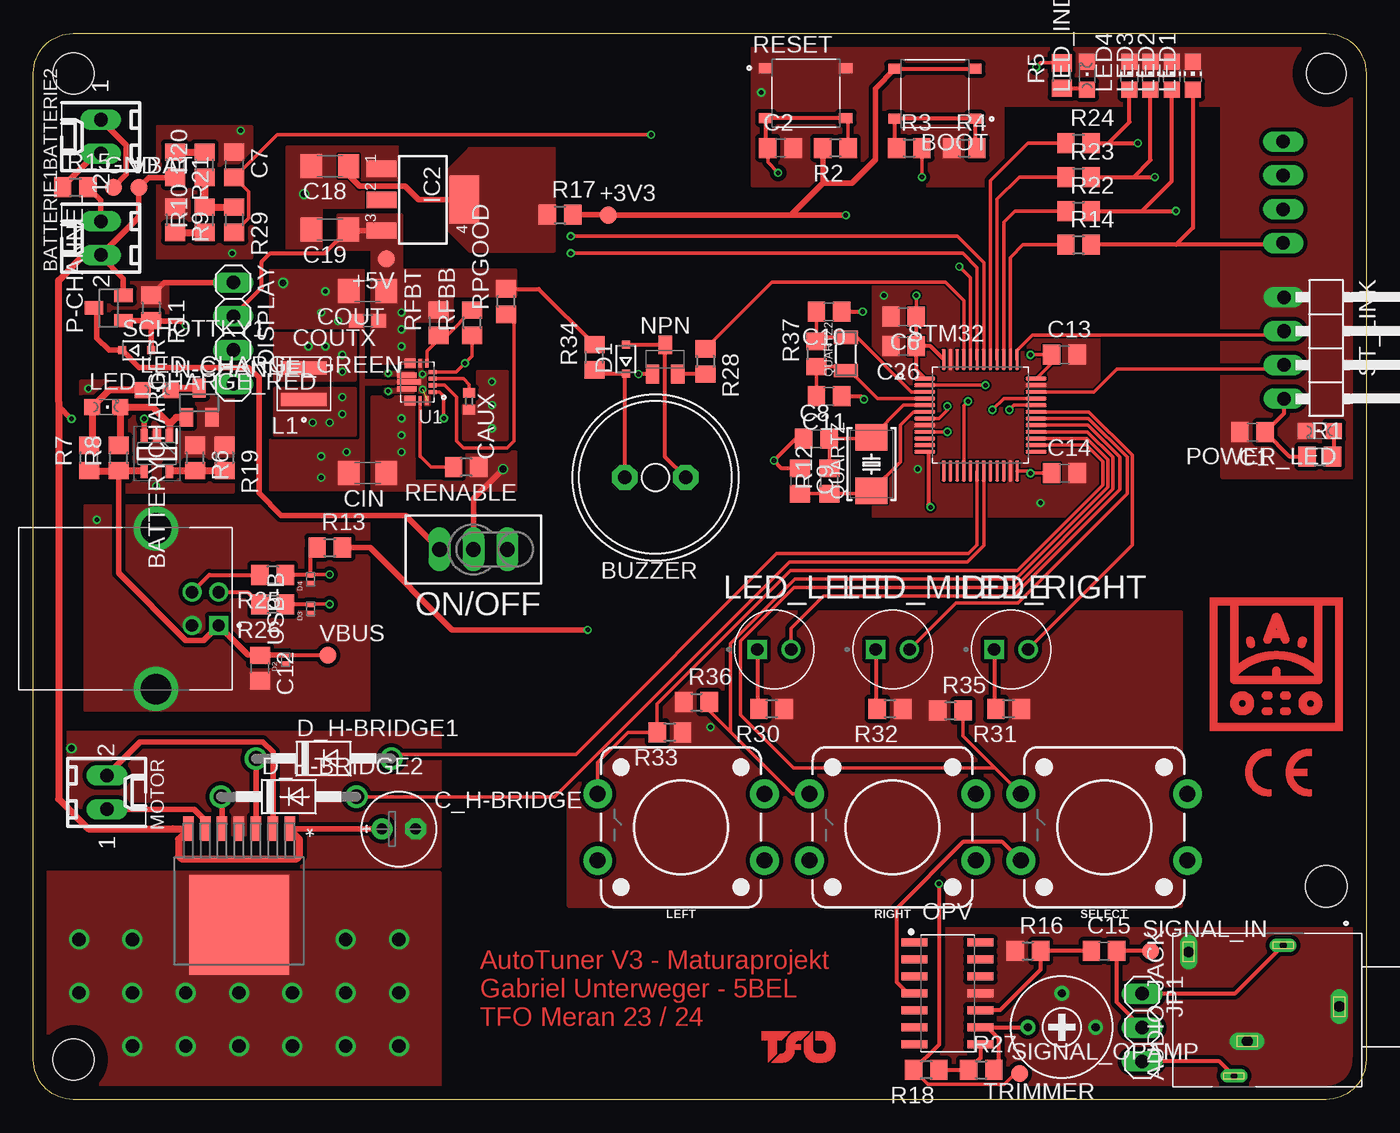
[diagram p4: board, top side]
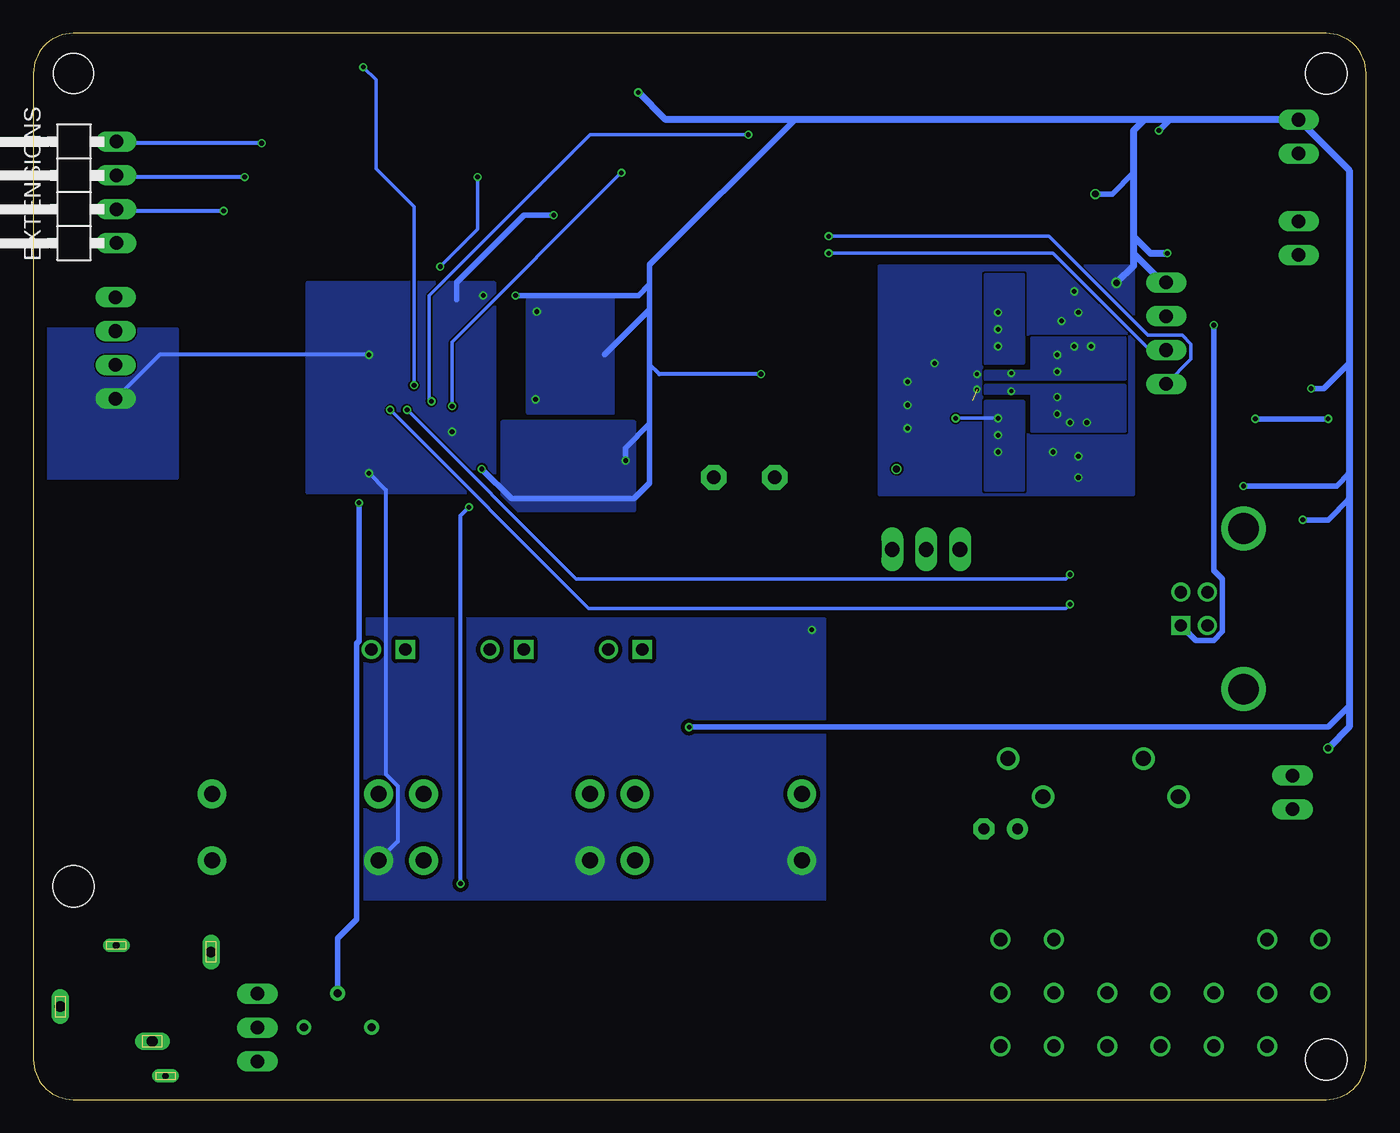
[diagram p5: board, bottom side, seen from below]

Size 100 x 80 mm. Coordinates in mm from the lower left corner, seen from the top.
Outline: 0,3 0,77 arc-90 3,80 97,80 arc-90 100,77 100,3 arc-90 97,0 3,0 arc-90 0,3
Copper layers (1*16): Top 0.035mm / dielectric 1.5mm / Bottom 0.035mm
Design rules "default *": minimum track width 6mil, minimum drill 0.3mm, track to track 5mil, track to pad 0.2mm, pad to pad 5mil, via to via 0.5mm, smd to smd 5mil, copper to edge 40mil, drill to drill 5mil, minimum pad ring 10mil, minimum via ring 0.13mm, stop-mask expansion 4mil, vias tented up to drill 0mil, thermal gap 10mil
Holes 3.1 mm at 3,77 3,3 97,16
Holes 3 mm at 97,77

### Footprints (pad centres in the part's own frame; a part is rotated, then mirrored left to right if it is on the bottom)
B1,27 = smd 1.27 x 1.27: TP 0,0
WENZHOU_PJ324M = drill 0.8 long: 1 0,5.4; 3 2.6,-1.5; 4 -4.1,-5.9 | drill 0.5 long: 2 5.2,-2.5; 5 -4.6,1.2
6410-02 = drill 1.016 long: 1 1.27,0; 2 -1.27,0
SOT95P280X100-5N = smd 1.05 x 0.55: 1 -1.3,0.95; 2 -1.3,0; 3 -1.3,-0.95; 4 1.3,-0.95; 5 1.3,0.95
SW_TS-1187A-B-A-B = smd 1 x 0.75: A -3,1.875; B 3,1.875; C -3,-1.875; D 3,-1.875
AL11P = drill 1.016 pad 1.905 octagon: + 2.286,0; - -2.286,0
C0805 = smd 1.3 x 1.5: 1 -0.95,0; 2 0.95,0
C1206 = smd 1.6 x 1.8: 1 -1.4,0; 2 1.4,0
E2,5-6E = drill 0.813 pad 1.575: + -1.27,0 | drill 0.813 pad 1.575 octagon: - 1.27,0
C0402 = smd 0.7 x 0.9: 1 -0.65,0; 2 0.65,0
C0603 = smd 1.1 x 1: 1 -0.85,0; 2 0.85,0
SOD323-R = smd 0.6 x 0.6: A 1.1,0; C -1.1,0
DIO_TESD5V0L1UC_RJG = smd 0.41 x 0.56: 1 -0.35,0; 2 0.35,0
DO41-10 = drill 1.118: A 5.08,0; C -5.08,0
1X04 = drill 1.016 long: 1 -3.81,0; 2 -1.27,0; 3 1.27,0; 4 3.81,0
1X04/90 = drill 1.016 long: 1 -3.81,-3.81; 2 -1.27,-3.81; 3 1.27,-3.81; 4 3.81,-3.81
HRP7_ROM-M = smd 0.787 x 1.854: 1 -3.81,-6.172; 2 -2.54,-6.172; 3 -1.27,-6.172; 4 0,-6.172; 5 1.27,-6.172; 6 2.54,-6.172; 7 3.81,-6.172 | smd 7.48 x 7.49: 8 0,1.051
SOT223 = smd 1.219 x 2.235: 1 -2.311,-3.099; 2 0,-3.099; 3 2.311,-3.099 | smd 3.6 x 2.2: 4 0,3.099
1X03 = drill 1.016 long: 1 -2.54,0; 2 0,0; 3 2.54,0
IND_XFL4020-152MEC = smd 0.98 x 3.4: 1 -1.185,0; 2 1.185,0
CHIP-LED0805 = smd 1.2 x 1.2: A 0,-1.05; C 0,1.05
CHIPLED_0805 = smd 1.2 x 1.2: A 0,-1.05; C 0,1.05
LEDRD254W50D500H1060 = drill 0.93 pad 1.4: A 1.27,0 | drill 0.93 pad 1.4 square: C -1.27,0
TACTILE_SWITCH_PTH_12MM = drill 1.2 pad 2.159: 1 6.25,-2.5; 2 -6.25,-2.5; 3 6.25,2.5; 4 -6.25,2.5
SOT23 = smd 1 x 1.4: 1 -0.95,-1.1; 2 0.95,-1.1; 3 0,1.1
SOT23-EBC = smd 1 x 1.4: B 0.95,-1.1; C 0,1.1; E -0.95,-1.1
TL3XPO = drill 1.1 pad 1.422 long: 1 -2.54,0; 2 0,0; 3 2.54,0
SOIC127P600X175-14N = smd 1.968 x 0.599: 1 -2.473,3.81; 2 -2.473,2.54; 3 -2.473,1.27; 4 -2.473,0; 5 -2.473,-1.27; 6 -2.473,-2.54; 7 -2.473,-3.81; 8 2.473,-3.81; 9 2.473,-2.54; 10 2.473,-1.27; 11 2.473,0; 12 2.473,1.27; 13 2.473,2.54; 14 2.473,3.81
CRYSTAL_2-SMD-5X3 = smd 2 x 2.4: 1 -2,0; 2 2,0
3.2X1.5 = smd 1 x 1.8: 1 -1.25,0; 2 1.25,0
R0805 = smd 1.3 x 1.5: 1 -0.95,0; 2 0.95,0
QFP50P900X900X160-48N = smd 1.56 x 0.28: 1 -4.18,2.75; 2 -4.18,2.25; 3 -4.18,1.75; 4 -4.18,1.25; 5 -4.18,0.75; 6 -4.18,0.25; 7 -4.18,-0.25; 8 -4.18,-0.75; 9 -4.18,-1.25; 10 -4.18,-1.75; 11 -4.18,-2.25; 12 -4.18,-2.75; 25 4.18,-2.75; 26 4.18,-2.25; 27 4.18,-1.75; 28 4.18,-1.25; 29 4.18,-0.75; 30 4.18,-0.25; 31 4.18,0.25; 32 4.18,0.75; 33 4.18,1.25; 34 4.18,1.75; 35 4.18,2.25; 36 4.18,2.75 | smd 0.28 x 1.56: 13 -2.75,-4.18; 14 -2.25,-4.18; 15 -1.75,-4.18; 16 -1.25,-4.18; 17 -0.75,-4.18; 18 -0.25,-4.18; 19 0.25,-4.18; 20 0.75,-4.18; 21 1.25,-4.18; 22 1.75,-4.18; 23 2.25,-4.18; 24 2.75,-4.18; 37 2.75,4.18; 38 2.25,4.18; 39 1.75,4.18; 40 1.25,4.18; 41 0.75,4.18; 42 0.25,4.18; 43 -0.25,4.18; 44 -0.75,4.18; 45 -1.25,4.18; 46 -1.75,4.18; 47 -2.25,4.18; 48 -2.75,4.18
RTRIM3339P = drill 0.61: 1 -2.54,0; 2 0,-2.54; 3 2.54,0
VREG_TPS63070RNMR = smd 0.6 x 0.25: 1 -1.15,0.75; 2 -1.15,0.25; 3 -1.15,-0.25; 4 -1.15,-0.75 | smd 0.25 x 0.6: 5 -0.725,-1.4; 6 -0.225,-1.4; 14 -0.225,1.4; 15 -0.725,1.4 | smd 0.85 x 0.7: 7_8 0.525,-1.4; 12_13 0.525,1.4 | smd 1.45 x 0.35: 9 0.775,-0.5; 11 0.775,0.5 | smd 1.8 x 0.35: 10 0.6,0
61729-1011BLF = drill 0.92 square: 1 1.25,4.71 | drill 0.92: 2 -1.25,4.71; 3 -1.25,2.71; 4 1.25,2.71 | drill 2.3: SH1 -6.02,0; SH2 6.02,0

### Placement (x,y rotation side)
+3V3  43.13,66.36 0 top
+5V  26.49,63.09 180 top
AUDIO_JACK  92.58,6.97 270 top
BATTERIE1  5.06,64.63 90 top
BATTERIE2  5.06,72.25 90 top
BATTERYCHARGER  9.27,48.47 270 top
BOOT  67.65,75.45 180 top
BUZZER  46.67,46.67 180 top
C1  91.47,50.07 180 top
C2  56.05,71.39 0 top
C6  65.29,58.74 180 top
C7  15.07,70.14 270 top
C8  58.75,49.59 0 top
C9  57.51,46.41 270 top
C10  59.7,59.12 180 top
C11  59.7,52.77 180 top
C12  17.01,32.37 270 top
C13  77.36,55.88 0 top
C14  77.36,46.99 0 top
C15  80.33,11.14 0 top
C18  22.25,70.05 180 top
C19  22.25,65.28 180 top
C26  65.29,56.52 180 top
C_H-BRIDGE  27.42,20.3 0 top
CAUX  32.7,52.39 270 top
CIN  25.08,46.99 180 top
COUT  25.08,60.64 180 top
COUTX  25.08,58.42 180 top
D1  44.45,55.56 90 top
D2  18.91,33.01 90 top
D3  20.82,36.82 90 top
D4  20.82,39.04 90 top
D_H-BRIDGE1  21.79,25.58 0 top
D_H-BRIDGE2  19.17,22.73 0 top
DISPLAY  15,57.5 270 top
EXTENSIONS  97.59,68.07 90 bottom
GND  6.01,68.44 0 top
H-BRUECKE  15.44,14.15 180 top
IC2  29.24,67.51 270 top
JP1  83.19,5.4 270 top
L1  20.29,53.7 90 top
LED1  87,76.83 0 top
LED2  85.41,76.83 0 top
LED3  83.82,76.83 0 top
LED4  82.23,76.83 0 top
LED_CHARGE_GREEN  9.27,53.23 270 top
LED_CHARGE_RED  5.46,51.96 270 top
LED_INDICATOR  79.06,76.83 0 top
LED_LEFT  55.58,33.77 0 top
LED_MIDDLE  64.47,33.77 0 top
LED_RIGHT  73.36,33.77 0 top
LEFT  48.6,20.43 180 top
MOTOR  5.51,23.04 270 top
N-CHANNEL  12.44,52.28 0 top
NPN  47.41,55.53 0 top
ON/OFF  33.02,41.27 180 top
OPV  68.59,7.97 0 top
P-CHANNEL  5.66,59.39 90 top
POWER_LED  96.52,50.16 90 top
QUARTZ  62.88,47.69 90 top
QUARTZ2  60.98,55.94 90 top
R1  96.52,48.26 0 top
R2  60.18,71.39 180 top
R3  65.72,71.39 0 top
R4  69.85,71.39 0 top
R5  77.15,76.83 90 top
R6  12.12,48.15 270 top
R7  4.19,48.15 90 top
R8  6.41,48.15 90 top
R9  10.63,66.01 270 top
R10  12.85,66.01 90 top
R11  8.83,59.39 270 top
R12  59.73,46.41 90 top
R13  22.25,41.42 0 top
R14  78.42,64.14 0 top
R15  3.15,68.44 0 top
R16  74.62,11.14 0 top
R17  39.52,66.38 0 top
R18  66.99,2.22 180 top
R19  14.35,48.15 270 top
R20  12.85,70.14 90 top
R21  10.63,70.14 270 top
R22  78.42,66.67 0 top
R23  78.42,69.22 0 top
R24  78.42,71.75 0 top
R25  17.96,39.36 180 top
R26  17.96,37.13 180 top
R27  71.12,2.24 0 top
R28  50.42,55.38 270 top
R29  15.07,66.01 270 top
R30  55.39,29.32 180 top
R31  73.17,29.32 180 top
R32  64.27,29.32 180 top
R33  47.76,27.56 180 top
R34  42.1,55.7 90 top
R35  68.81,29.18 0 top
R36  49.76,29.82 0 top
R37  58.75,55.94 90 top
RENABLE  32.48,47.44 180 top
RESET  57.96,75.52 0 top
RFBB  32.93,58.28 90 top
RFBT  30.39,58.28 90 top
RIGHT  64.47,20.43 180 top
RPGOOD  35.47,59.87 90 top
SCHOTTKY1  7.76,56.22 0 top
SELECT  80.35,20.43 180 top
SIGNAL_IN  83.83,11.14 0 top
SIGNAL_OPAMP  73.98,1.94 0 top
ST_LINK  97.64,56.39 270 top
STM32  71.06,51.35 0 top
TRIMMER  77.16,5.43 180 top
U1  28.8,53.84 180 top
USB-B  9.2,36.82 270 top
VBAT  7.92,68.44 0 top
VBUS  22.09,33.33 0 top

### Tracks (layer width: path | path; a pad name or v marks a point on that pad's centre or on a via)
+3V3  (via drill 0.35)
  Top 0.254: STM32.36 76.41,55.27 C13.1 v74.82,55.88 | STM32.24 74.64,47.17 v74.82,46.99 C14.1 | C6.1 v66.24,60.33 | STM32.9 v68.58,50.1
  Top 0.305: BOOT.D BOOT.C | C26.1 C6.1 | STM32.48 67.32,56.52 C26.1 | STM32.1 66.24,54.73 C26.1 | ST_LINK.4 93.83,51.47 C1.1 94.23,48.26 R1.1 | OPV.4 65.6,7.97 64.78,8.79 64.78,14.34 69.8,19.36 72.67,19.36 SELECT.3
  Top 0.406: R2.2 59.23,68.76 | 59.23,68.76 56.83,66.36 | BOOT.D 63.18,75.86 63.18,70.52 61.42,68.76 59.23,68.76 | 56.83,66.36 v60.96,66.36 | R13.2 25.25,41.42 31.43,35.24 v41.59,35.24 | R17.2 43.11,66.38 +3V3.TP 56.83,66.36
  Bottom 0.305: v74.82,55.88 90.52,55.88 ST_LINK.4 | v74.82,46.99 73.56,45.73 73.56,24.42 72.67,23.53 72.67,19.36 SELECT.3
  Bottom 0.406: v60.96,66.36 63.18,66.36 68.26,61.28 68.26,60.01
  pour Bottom (no thermals): 65.44,45.54 79.41,45.54 79.41,61.29 65.44,61.29
  pour Bottom (isolate 0.305, no thermals): 40.67,15.05 85.63,15.05 85.63,36.05 40.67,36.05
  pour Bottom (no thermals): 89.22,57.78 100.01,57.78 100.01,46.67 89.22,46.67
+5V  (via drill 0.35)
  Top 0.305: RPGOOD.2 37.92,60.82 R34.2 | DISPLAY.2 17.14,60.91 17.14,62.87 17.78,63.5 21.87,63.5 C19.1
  Top 0.406: IC2.3 23.74,65.2 C19.1
  other vias: 27.62,56.52 27.62,57.78 27.62,59.05
  pour Bottom (no thermals): 28.57,61.91 25.72,61.91 25.72,55.24 28.57,55.24
  pour Top (isolate 0.254, no thermals): 28.57,55.24 25.4,55.24 25.4,63.82 22.86,63.82 22.86,66.36 27.62,66.36 27.62,62.23 36.2,62.23 36.2,60.33 31.43,60.33 31.43,58.42 28.57,58.42
BATTERY_LEVEL  (via drill 0.35)
  Top 0.254: v70.13,52.39 69.81,52.07 STM32.16 | v46.35,72.39 18.27,72.39 C7.2 16.15,68.11 16.15,66.14 R29.2
  Bottom 0.254: v70.13,52.39 70.31,52.57 70.31,60.31 58.22,72.39 v46.35,72.39
BOOT0  (via drill 0.35)
  Top 0.254: STM32.44 70.31,61.65 v69.47,62.49 | v66.67,69.22 R3.2
  Bottom 0.254: v69.47,62.49 66.67,65.29 v66.67,69.22
BUTTON_1
  Top 0.254: LEFT.1 42.35,25.3 44.61,27.56 R33.2 46.81,29.68 56.81,39.69 73.82,39.69 80.24,46.1 80.24,47.88 79.02,49.1 STM32.26
BUTTON_2
  Top 0.254: RIGHT.1 56.95,22.93 52.32,27.57 | 52.32,27.57 50.7,29.18 R36.2 | R36.2 | STM32.27 79.06,49.6 80.62,48.03 80.62,45.95 73.72,39.05 57.16,39.05 52.32,34.21 52.32,27.57
BUTTON_3
  Top 0.254: R35.2 69.75,27.27 SELECT.1 72.15,24.88 57.02,24.88 53.04,28.86 53.04,34.4 57.06,38.42 73.63,38.42 81,45.79 81,48.19 79.09,50.1 STM32.28
BUZZER
  Top 0.254: STM32.45 69.81,59.95 68.43,61.33 55.42,61.33 R28.1
CUSTOM1
  Top 0.254: STM32.38 73.31,63.18 74.26,64.14 R14.1
CUSTOM2
  Top 0.254: STM32.39 72.81,65.82 73.66,66.67 R22.1
CUSTOM3
  Top 0.254: R23.1 73.98,69.22 72.31,67.55 STM32.40
CUSTOM4
  Top 0.254: STM32.41 71.81,68.95 74.61,71.75 R24.1
DISPLAY_SCL  (via drill 0.35)
  Top 0.254: STM32.42 71.31,62.79 69.33,64.77 v40.32,64.77
  Bottom 0.254: DISPLAY.4 13.15,55.54 13.15,56.68 13.81,57.34 16.39,57.34 23.81,64.77 v40.32,64.77
DISPLAY_SDA  (via drill 0.35)
  Top 0.254: STM32.43 70.81,62.44 69.75,63.5 v40.32,63.5
  Bottom 0.254: DISPLAY.3 15.03,56.2 16.19,56.2 23.5,63.5 v40.32,63.5
GND  (via drill 0.3, 0.35, 0.5)  (1 unrouted)
  Top 0.254: RFBB.1 32.93,55.79 v32.38,55.24 31.73,54.59 U1.4
  Top 0.305: C10.1 v62.23,59.12 | C11.1 62.09,52.77 v62.32,52.54 | C9.1 56.15,47.36 v55.56,47.94 57.21,49.59 C8.1 | NPN.E v45.4,54.43
  Top 0.406: R11.1 9.8,61.31 DISPLAY.1 | BATTERIE2.1 6.99,71.59 6.99,69.42 GND.TP
  Bottom 0.305: v45.4,54.43 53.03,54.43 53.75,55.15
  Bottom 0.406: 1.27,45.09 2.86,43.5 v4.76,43.5 | 1.27,55.24 3.17,53.34 v4.13,53.34 | 17.46,69.53 19.05,67.94 v20.32,67.94 | 1.27,46.99 2.22,46.04 v9.21,46.04 | 42.86,73.52 53.75,62.63 53.75,61.18 | 53.75,61.18 53.75,59.28 | 53.75,59.28 53.75,55.15 53.75,50.7 | v55.56,47.94 55.56,48.9 53.75,50.7 | 1.27,29.53 2.86,27.94 v50.8,27.94 | 13.02,73.52 14.74,73.52 v15.56,72.71 | v75.56,44.77 75.56,34.42 75.75,34.23 75.75,13.5 77.16,12.1 TRIMMER.2 | 53.75,59.28 57.15,55.88 | v66.36,47.31 64.14,45.09 54.93,45.09 53.75,46.26 53.75,50.7 | v63.82,60.33 54.61,60.33 53.75,61.18
  Bottom 0.508: v2.86,26.35 1.27,27.94 1.27,29.53 1.27,45.09 1.27,46.99 1.27,55.24 1.27,69.73 BATTERIE2.1 13.02,73.52 16.65,73.52 | 16.65,73.52 17.46,72.71 17.46,69.53 17.46,64.77 | 16.65,73.52 42.86,73.52 52.56,73.52 v54.61,75.56 | 17.46,64.77 17.46,63.5 | DISPLAY.1 15.27,61.31 17.46,63.5 | 17.46,64.77 16.19,63.5 v14.92,63.5 | 17.46,63.5 17.46,62.55 v18.73,61.28
  other vias: 34.41,53.86 21.91,60.64 21.59,46.67 23.5,48.58 22.86,58.42 29.21,53.27 29.2,54.42 34.41,50.36 34.41,52.11 21.59,48.26 21.59,59.05
  pour Top (isolate 0.305, no thermals): 30.5,27.5 0.5,27.5 0.5,17.5 30.5,17.5
  pour Top (isolate 0.305, no thermals): 25.14,29.23 3.92,29.23 3.92,44.55 25.14,44.55
  pour Top (isolate 0.305, no thermals): 16.34,63.15 9.36,63.15 9.36,73 16.34,73
  pour Top (isolate 0.305, no thermals): 10.03,61.28 10.03,55.15 3.4,55.15 3.4,61.28
  pour Bottom (isolate 0.305, no thermals): 64.78,50.86 54.94,50.86 54.94,44.19 64.78,44.19
  pour Bottom (isolate 0.305, no thermals): 56.53,60.38 56.53,51.49 62.88,51.49 62.88,60.38
  pour Top (isolate 0.305, no thermals): 99.5,0.5 64.55,0.5 64.55,12.82 99.5,12.82
  pour Top (no thermals): 79.91,43.77 63.06,43.77 63.06,61.48 79.91,61.48
  pour Top (isolate 0.305, no thermals): 40.17,14.55 86.13,14.55 86.13,36.55 40.17,36.55
  pour Top (isolate 0.305, no thermals): 3.55,45.61 14.98,45.61 14.98,53.87 3.55,53.87
  pour Top (isolate 0.305, no thermals): 53.98,79.69 100.01,79.69 100.01,46.67 89.22,46.67 89.22,74.61 72.71,74.61 72.71,68.58 53.98,68.58
  pour Top (isolate 0.203, rank 2, no thermals): 24.77,45.72 24.77,53.66 28.57,53.66 28.57,53.98 24.77,53.98 24.77,62.23 17.78,62.23 17.78,45.72
  pour Bottom (rank 2, no thermals): 36.51,45.4 36.51,62.55 17.46,62.55 17.46,45.4
  pour Top (isolate 0.127, no thermals): 29.53,52.78 29.53,54.61 29.21,54.61 29.21,55.56 28.89,55.56 28.89,53.02 29.29,53.02 29.29,52.07 29.77,52.07 29.77,52.78
  pour Top (isolate 0.254, no thermals): 32.07,52.07 32.07,49.53 35.56,49.53 35.56,54.61 33.34,54.61 33.34,52.07
  pour Top (no thermals): 19.05,71.44 19.05,63.82 21.59,63.82 21.59,66.99 27.3,66.99 27.3,71.44
L1  (via drill 0.3, 0.35)
  other vias: 23.18,52.7 23.18,51.44 22.23,50.8 20.95,50.8 26.63,53.14
  pour Bottom (no thermals): 28.57,53.02 28.57,53.58 18.1,53.58 18.1,50.16 25.08,50.16 25.08,53.02
  pour Top (isolate 0.254, no thermals): 24.13,49.85 18.1,49.85 18.1,53.34 24.13,53.34
  pour Top (isolate 0.127, no thermals): 28.57,53.02 28.57,53.34 26.35,53.34 26.35,53.02
L2  (via drill 0.3, 0.35)
  other vias: 23.18,54.61 23.18,55.88 21.91,56.52 20.64,56.52 26.63,54.49
  pour Bottom (no thermals): 28.57,54.05 18.1,54.05 18.1,57.15 25.08,57.15 25.08,54.61 28.57,54.61
  pour Top (isolate 0.254, no thermals): 24.13,53.98 18.1,53.98 18.1,57.47 24.13,57.47
  pour Top (isolate 0.127, no thermals): 28.57,54.29 28.57,54.61 26.35,54.61 26.35,54.29
LED_LEFT
  Top 0.254: LED_LEFT.A 56.85,35.35 59.28,37.78 73.53,37.78 81.51,45.76 81.51,48.22 79.13,50.6 STM32.29
LED_MIDDLE
  Top 0.254: STM32.30 79.17,51.1 82.08,48.19 82.08,45.47 73.86,37.26 69.23,37.26 LED_MIDDLE.A
LED_RIGHT
  Top 0.254: STM32.31 79.21,51.6 82.46,48.35 82.46,41.59 LED_RIGHT.A
MOTOR_PWM1
  Top 0.254: STM32.18 70.81,41.59 70.17,40.96 55.77,40.96 40.71,25.9 27.18,25.9 D_H-BRIDGE1.A
MOTOR_PWM2
  Top 0.254: D_H-BRIDGE2.A 39.12,22.73 56.72,40.32 70.08,40.32 71.31,41.55 STM32.19
MOTORA
  Top 0.406: MOTOR.2 8.03,26.82 17.22,26.82 17.98,26.07 H-BRUECKE.2
MOTORB
  Top 0.406: MOTOR.1 12.07,21.77 12.89,20.94 H-BRUECKE.6
N$1
  Top 0.305: POWER_LED.A 97.57,48.36 R1.2
N$2
  Top 0.305: R5.1 78.96,75.89 LED_INDICATOR.A
N$3
  Top 0.406: P-CHANNEL.3 4.76,59.19 4.76,57.15 5.7,56.22 SCHOTTKY1.C 7.95,54.93 16.17,54.93 16.93,54.17 16.93,45.5 18.61,43.81 27.94,43.81 ON/OFF.3
N$4
  Top 0.508: R9.2 R10.1
N$5
  Top 0.305: R3.1 64.65,71.52 BOOT.B BOOT.A 70.65,71.54 R4.2
N$6
  Top 0.406: H-BRUECKE.3 D_H-BRIDGE1.C
N$7
  Top 0.305: R18.1 67.95,2.23 R27.1 71.06,3.13 OPV.8
N$8
  Top 0.508: BATTERYCHARGER.5 10.25,47.2 R6.2 R19.2
N$9
  Top 0.508: R8.2 6.51,49.2 LED_CHARGE_RED.C 8.95,51.96 10.22,50.69 | 10.22,50.69 BATTERYCHARGER.1 | N-CHANNEL.1 10.71,51.18 10.22,50.69
N$11
  Top 0.508: LED_CHARGE_GREEN.A 5.68,53.23 LED_CHARGE_RED.A 4.41,49.32 R7.2
N$12
  Top 0.508: LED_CHARGE_GREEN.C 10.46,53.38 N-CHANNEL.3
N$13
  Top 0.406: IC2.4 28.92,67.51 27.91,68.52 24.48,68.52 23.65,69.34 C18.1
  pour Top (isolate 0.305, no thermals): 31.14,69.73 31.14,65.28 32.73,63.7 39.08,63.7 39.08,71.32 32.73,71.32
N$14
  Top 0.406: D_H-BRIDGE2.C 14.16,22.65 H-BRUECKE.5
N$16
  Top 0.305: TRIMMER.3 OPV.9 71.57,5.43 72.4,4.61 72.4,2.56 R27.2
N$19
  Top 0.305: R30.2 54.31,29.45 LED_LEFT.C
N$20
  Top 0.305: R31.2 72.09,29.45 LED_RIGHT.C
N$23
  Top 0.305: R32.2 63.2,29.44 LED_MIDDLE.C
N$29
  Top 0.305: USB-B.3 13.2,39.36 R25.2
N$30
  Top 0.305: USB-B.2 16.07,38.07 R26.2
N$39
  Top 0.305: EXTENSIONS.1 93.65,64.14 85.72,64.14 | 85.72,64.14 R14.2 | LED1.A 87,65.41 85.72,64.14
N$46
  Top 0.508: R21.1 R20.2
N$47
  Top 0.508: R20.1 R10.2 R29.1
N$48  (via drill 0.35)
  Top 0.305: R22.2 83.19,66.67 | 83.19,66.67 85.41,68.9 LED2.A | 83.19,66.67 v85.72,66.67
  Bottom 0.305: v85.72,66.67 93.65,66.67 EXTENSIONS.2
N$49  (via drill 0.35)
  Top 0.305: R23.2 82.55,69.22 | 82.55,69.22 83.82,70.48 LED3.A | 82.55,69.22 v84.14,69.22
  Bottom 0.305: v84.14,69.22 93.65,69.22 EXTENSIONS.3
N$50  (via drill 0.35)
  Top 0.305: R24.2 80.64,71.75 | 80.64,71.75 82.23,73.34 LED4.A | 80.64,71.75 v82.87,71.75
  Bottom 0.305: v82.87,71.75 93.65,71.75 EXTENSIONS.4
N$51
  Top 0.406: BATTERIE2.2 4.67,70.98 2.21,68.51 R15.1
N$52
  Top 0.305: C15.1 R16.2 75.57,9.74 72.53,6.7 OPV.10
N$53
  Top 0.406: BATTERIE1.1 5.06,67.49 R15.2
N$54
  Top 0.305: D1.A 47.38,56.66 NPN.C 47.41,48.22 BUZZER.-
N$55
  Top 0.305: R34.1 42.38,54.46 D1.C 44.39,54.4 BUZZER.+
N$56
  Top 0.305: R28.2 NPN.B
N$60
  Top 0.254: CAUX.1 32.7,53.66 32.27,54.09 U1.3
N$61
  Top 0.254: U1.2 30.86,53.59 31.75,52.7 31.75,49.41 32.27,48.9 35.56,48.9 36.06,49.39 36.06,58.34 RPGOOD.1
N$62
  Top 0.254: U1.5 29.53,56.16 30.39,57.02 RFBT.1 31.03,57.34 RFBB.2
N$64
  Top 0.203: U1.14 29.03,52.07
  Top 0.254: RENABLE.2 29.84,47.44 29.12,48.17 29.03,48.26 29.03,52.07
OSC32IN
  Top 0.254: C10.2 R37.2 59.05,57.19 QUARTZ2.2 61.8,57.19 65.9,53.1 STM32.3
OSC32OUT
  Top 0.254: C11.2 R37.1 60.67,54.99 QUARTZ2.1 61.24,54.69 63.34,52.6 STM32.4
OSCIN
  Top 0.254: R12.2 59.73,49.56 C8.2 62.78,49.59 QUARTZ.2 65.29,52.1 STM32.5
OSCOUT
  Top 0.254: C9.2 R12.1 62.65,45.46 QUARTZ.1 65.04,47.85 65.04,50.6 66.04,51.6 STM32.6
PAD  (via drill 1)
  other vias: 23.43,8.01 3.44,12.01 7.43,12.01 3.44,8.01 7.43,8.01 7.43,4.01 11.44,8.01 23.43,12.01 27.43,12.01 27.43,8.01 19.43,8.01 15.44,8.01 15.44,4.01 11.44,4.01 19.43,4.01 23.43,4.01 27.43,4.01
  pour Top (isolate 0.305, no thermals): 0.5,0.5 30.5,0.5 30.5,17 0.5,17
PC13  (via drill 0.35)
  Top 0.254: v75.25,77.47 75.56,77.78 R5.2 | STM32.2 v71.44,53.6
  Bottom 0.254: v75.25,77.47 74.3,76.52 74.3,69.85 71.44,66.99 v71.44,53.6
RESET  (via drill 0.35)
  Top 0.254: STM32.7 67.94,51.1 68.58,51.73 v68.58,52.02 | C2.1 55.1,70.32 55.88,69.54 v55.88,69.53 | 61.13,73.47 R2.1
  Top 0.305: C2.1 54.96,71.53 RESET.C RESET.D 61.13,73.47
  Bottom 0.254: v68.58,52.02 68.58,56.85 55.89,69.53 v55.88,69.53
SIGNAL_IN
  Top 0.305: SIGNAL_IN.TP C15.2 81.28,7.3 JP1.2
SIGNAL_IN_1
  Top 0.305: JP1.1 90.14,7.94 AUDIO_JACK.5
SIGNAL_IN_2
  Top 0.305: AUDIO_JACK.2 88.99,2.86 JP1.3
SIGNAL_OPAMP  (via drill 0.35)
  Top 0.254: SIGNAL_OPAMP.TP 73.64,1.94 72.84,1.15 67.12,1.15 R18.2
  Top 0.305: v67.31,44.45 67.14,44.62 67.14,48.6 STM32.12 | v67.94,16.19 67.94,4.12 R18.2
  Bottom 0.305: v67.94,16.19 67.94,43.81 v67.31,44.45
SWDCLK
  Top 0.254: STM32.37 73.81,56.2 74.95,57.34 93.51,57.34 ST_LINK.2
SWDIO
  Top 0.254: STM32.34 79.58,53.1 81.28,54.8 93.51,54.8 ST_LINK.3
USB+  (via drill 0.35)
  Top 0.254: D4.2 v22.23,39.39 | STM32.33 72.8,52.6 v71.96,51.75
  Top 0.305: 18.94,39.39 D4.2 20.82,41.42 R13.1
  Top 0.406: R25.1 18.94,39.39
  Bottom 0.254: v71.96,51.75 59.28,39.07 22.54,39.07 v22.23,39.39
USB-  (via drill 0.35)
  Top 0.254: D3.2 v22.23,37.17 | v73.23,51.75 73.57,52.1 STM32.32
  Top 0.305: 18.94,37.17 D3.2
  Top 0.406: R26.1 18.94,37.17
  Bottom 0.254: v73.23,51.75 58.33,36.85 22.54,36.85 v22.23,37.17
VBAT  (via drill 0.35)
  Top 0.406: C_H-BRIDGE.+ 19.26,20.3 H-BRUECKE.1 | P-CHANNEL.2 6.76,61.61 5.06,63.31 BATTERIE1.2 7.92,66.22 VBAT.TP 8.66,69.19 R21.2 | BATTERYCHARGER.3 v8.32,51.07 | v2.86,51.07 1.91,52.03 1.91,52.39
  Top 0.508: 19.26,20.3 19.26,20.24 19.97,19.53 19.97,18.27 19.77,18.07 11.1,18.07 10.9,18.27 10.9,19.53 11.62,20.26 H-BRUECKE.7 10.48,20.32 4.13,20.32 1.91,22.54 1.91,52.39 1.91,61.45 3.76,63.31 5.06,63.31
  Bottom 0.406: v8.32,51.07 v2.86,51.07
VBUS  (via drill 0.35)
  Top 0.305: 17.01,33.35 C12.1 | BATTERYCHARGER.4 | 6.41,47.17 R8.1 | D2.2 22.05,33.36 VBUS.TP
  Top 0.406: C12.1 16.98,33.35 16.13,33.35 USB-B.1 12.79,34.45 11.45,34.45 6.41,39.49 R8.1 | D2.2 18.9,33.35 17.01,33.35 | SCHOTTKY1.A 8.86,58.41 | P-CHANNEL.1 R11.2 8.86,58.41 | v11.43,58.1 11.11,58.42 8.87,58.42 8.86,58.41
  Top 0.508: R7.1 4.22,47.17 6.41,47.17 | R8.1 8.28,47.2 BATTERYCHARGER.4
  Bottom 0.406: v11.43,58.1 11.43,39.69 10.79,39.05 10.79,35.11 11.45,34.45 12.79,34.45 USB-B.1
VIN  (via drill 0.35, 0.5)
  Top 0.254: U1.1 30.48,53.09 30.8,52.77 v30.8,51.12
  Top 0.406: ON/OFF.2 33.02,45.09 v35.24,47.31
  Bottom 0.254: v27.62,51.12 v30.8,51.12
  other vias: 27.62,48.58 27.62,49.85
  pour Bottom (no thermals): 28.57,52.39 25.72,52.39 25.72,45.72 28.57,45.72
  pour Top (isolate 0.254, no thermals): 28.57,52.7 25.4,52.7 25.4,45.72 36.2,45.72 36.2,48.58 32.38,48.58 32.38,46.35 28.57,46.35
(copper drawn outside any net)
  shapes: Top area x2980

### Text on the board
Top: AutoTuner V3 - Maturaprojekt / Gabriel Unterweger - 5BEL / TFO Meran 23 / 24
tStop: AutoTuner V3 - Maturaprojekt / Gabriel Unterweger - 5BEL / TFO Meran 23 / 24
Einteilung: Reset | Boot | BuildInLED | + - | Battery 1 | Extenions | GND | VBAT | +3V3 | +5V | 5V->3V3 | + - | VBAT LVL | Battery 2 | ST-Link | V Selection | Power | BAT Charger | microcontroller | Buzzer | VBUS | USB | MOTOR | DC Driver | Buttons / LEDs | SIGNAL_IN | SIGNAL_OPAMP | Input